# Altium project USB PD Hub.PrjPcb (part 1 of 2)
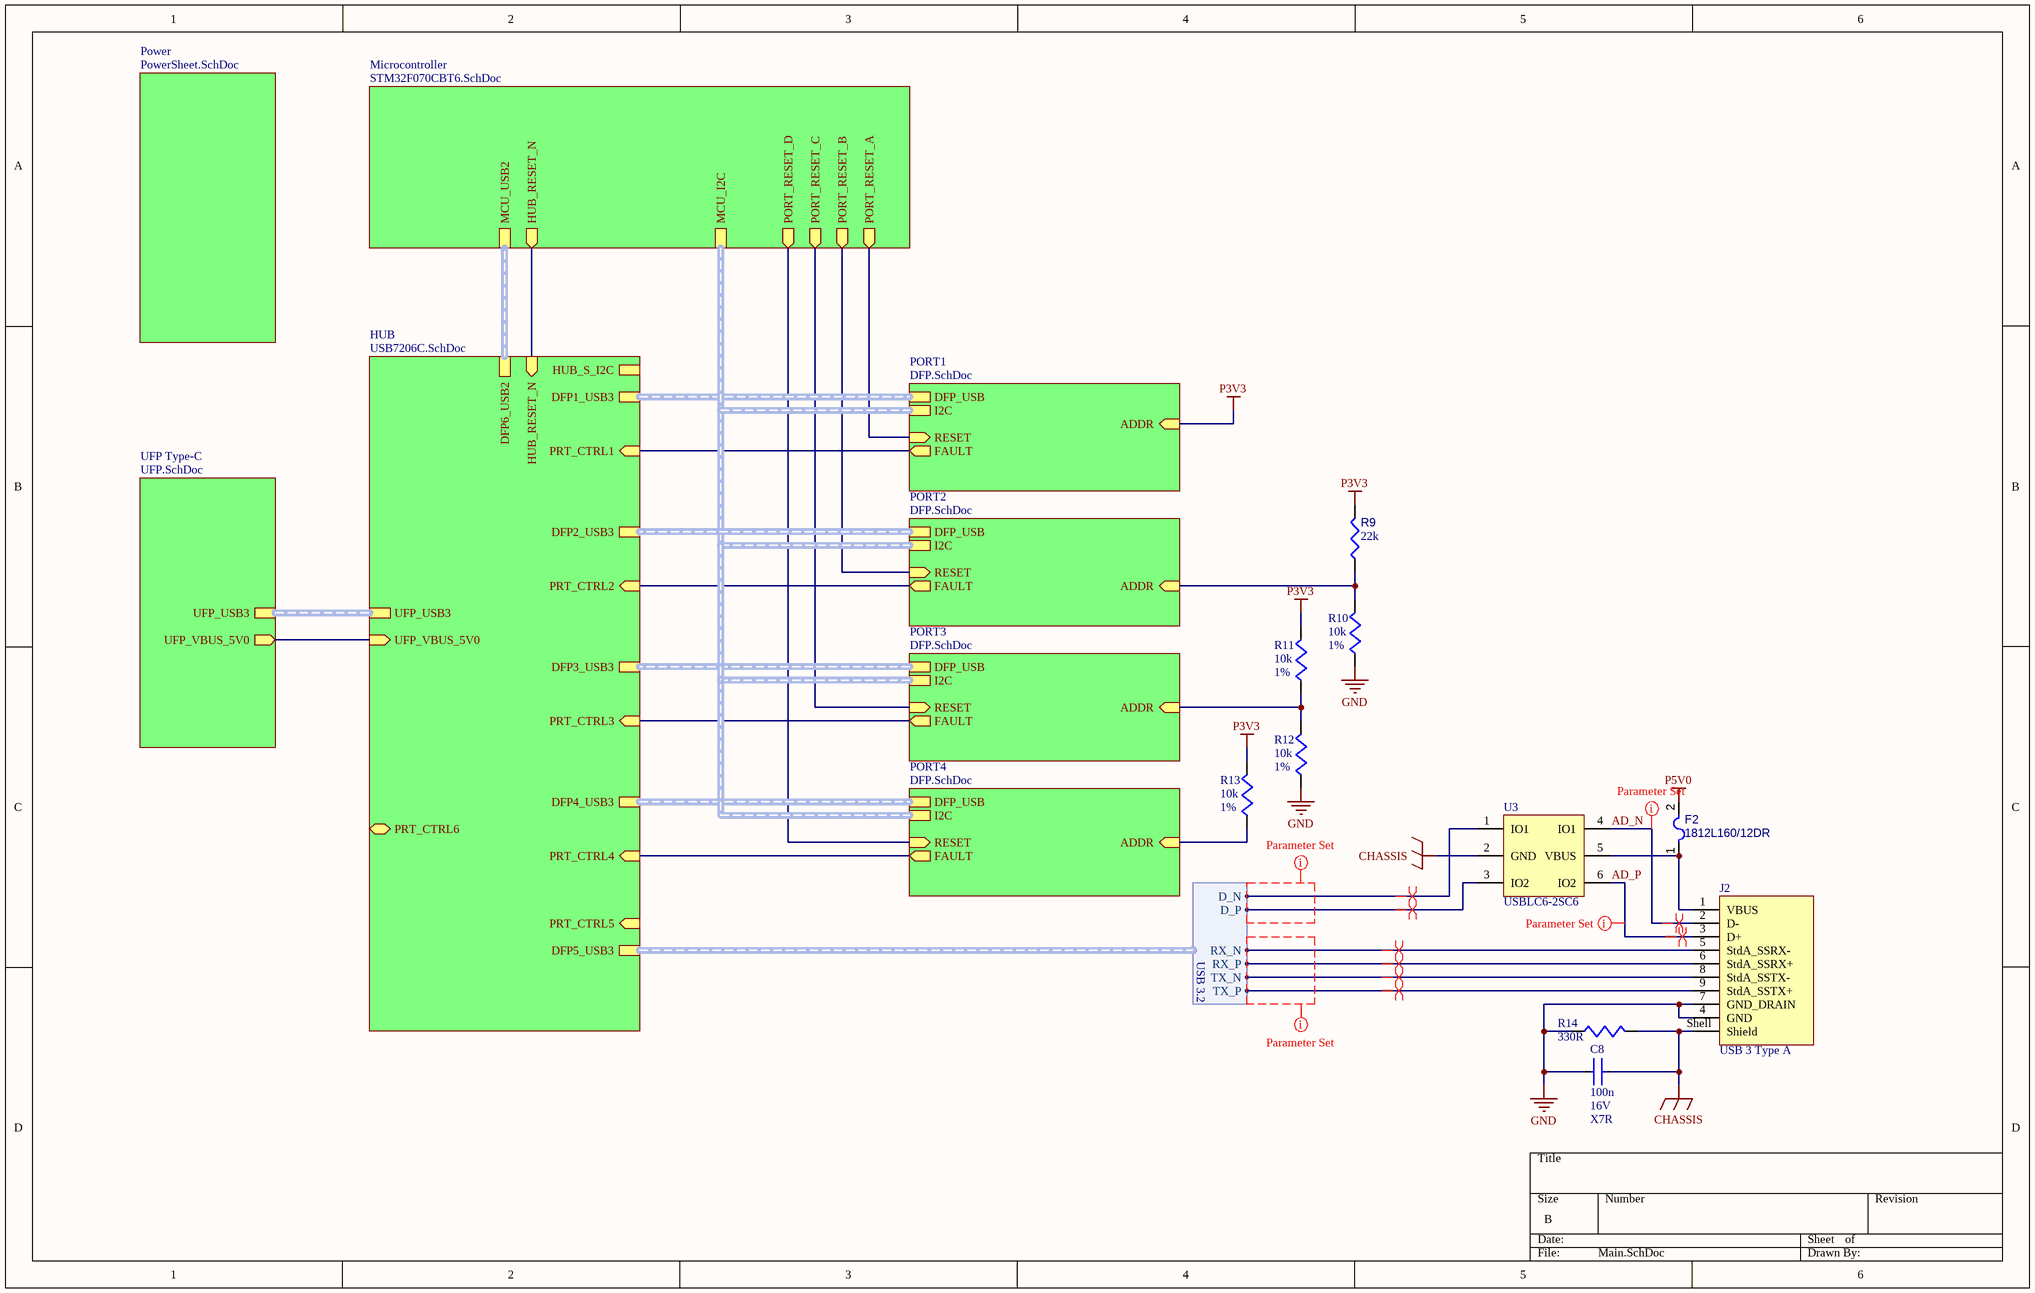
[diagram p0: Main.SchDoc]
8 sheets, 489 parts. Net scope: hierarchical (ports join the sheet entries above them; power ports are global).
Board file: PCB.PcbDoc
Sheets:
  Main.SchDoc
    PORT1 = DFP.SchDoc
      PD Controller = PD Controller.SchDoc
      PD Regulator = PD Regulator.SchDoc
    PORT2 = DFP.SchDoc
      PD Controller = PD Controller.SchDoc
      PD Regulator = PD Regulator.SchDoc
    PORT3 = DFP.SchDoc
      PD Controller = PD Controller.SchDoc
      PD Regulator = PD Regulator.SchDoc
    PORT4 = DFP.SchDoc
      PD Controller = PD Controller.SchDoc
      PD Regulator = PD Regulator.SchDoc
    UFP Type-C = UFP.SchDoc
    Microcontroller = STM32F070CBT6.SchDoc
    HUB = USB7206C.SchDoc
    Power = PowerSheet.SchDoc

## Sheet Main.SchDoc
size B; SheetNumber: 1; SheetTotal: 8

### Parts
C8  value 100n  Voltage: 16V  Dielectric: X7R  [CAPC1005X06N]  (hidden comment: 100nF 16V 0402)
F2  1812L160/12DR  [LFUS-1812L16012_V]
J2  USB 3 Type A  [692121030100]
R9  value 22k  [RESC0402(1005)_L]  (hidden comment: 22KR2F)
R10  value 10k  Tolerance: 1%  [RESC1005X04M]  (hidden comment: 10k 1% 0402)
R11  value 10k  Tolerance: 1%  [RESC1005X04M]  (hidden comment: 10k 1% 0402)
R12  value 10k  Tolerance: 1%  [RESC1005X04M]  (hidden comment: 10k 1% 0402)
R13  value 10k  Tolerance: 1%  [RESC1005X04M]  (hidden comment: 10k 1% 0402)
R14  value 330R  [RESC1005X04M]  (hidden comment: 330R 1% 0402)
U3  USBLC6-2SC6  [SOT95P280X145-6N]

### Sub-sheets
HUB = USB7206C.SchDoc: UFP_USB3 (harness USB 3.2), DFP1_USB3 (harness USB 3.2), DFP2_USB3 (harness USB 3.2), DFP3_USB3 (harness USB 3.2), DFP4_USB3 (harness USB 3.2), DFP6_USB2 (harness USB 2.0), UFP_VBUS_5V0 (in), DFP5_USB3 (harness USB 3.2), PRT_CTRL4 (in), PRT_CTRL3 (in), PRT_CTRL2 (in), PRT_CTRL1 (in), PRT_CTRL6 (bidir), HUB_S_I2C (harness S_I2C), HUB_RESET_N (in), PRT_CTRL5 (in)
Microcontroller = STM32F070CBT6.SchDoc: MCU_USB2 (harness USB 2.0), MCU_I2C, PORT_RESET_A (out), PORT_RESET_B (out), PORT_RESET_C (out), PORT_RESET_D (out), HUB_RESET_N (out)
PORT1 = DFP.SchDoc: DFP_USB (harness USB 3.2), I2C (harness I2C), ADDR (in), RESET (in), FAULT (out)
PORT2 = DFP.SchDoc: DFP_USB (harness USB 3.2), I2C (harness I2C), ADDR (in), RESET (in), FAULT (out)
PORT3 = DFP.SchDoc: DFP_USB (harness USB 3.2), I2C (harness I2C), ADDR (in), RESET (in), FAULT (out)
PORT4 = DFP.SchDoc: DFP_USB (harness USB 3.2), I2C (harness I2C), ADDR (in), RESET (in), FAULT (out)
Power = PowerSheet.SchDoc: no entries
UFP Type-C = UFP.SchDoc: UFP_USB3 (harness USB 3.2), UFP_VBUS_5V0 (out)

### Harnesses
USB 3.2: D_P, D_N, TX_P, TX_N, RX_P, RX_N

### Nets
CHASSIS: C8.1 J2.Shell(Shield) R14.2 U3.2(GND)
GND: C8.2 J2.4(GND) J2.7(GND_DRAIN) R10.1 R12.1 R14.1
P3V3: R9.2 R11.2 R13.2 ; sheet PORT1/ADDR
P5V0: F2.2
P5V0_UFP: sheet UFP Type-C/UFP_VBUS_5V0, sheet HUB/UFP_VBUS_5V0
AD_N: J2.2(D-) U3.4(IO1)
AD_P: J2.3(D+) U3.6(IO2)
ADCIN2: R9.1 R10.2 ; sheet PORT2/ADDR
ADCIN2: R11.1 R12.2 ; sheet PORT3/ADDR  [a separate net that carries the same name]
ADCIN2: R13.1 ; sheet PORT4/ADDR  [a separate net that carries the same name]
DP5_USB2_N: U3.1(IO1) ; sheet HUB/DFP5_USB3.D_N
DP5_USB2_P: U3.3(IO2) ; sheet HUB/DFP5_USB3.D_P
DP5_USB3_RX_N: J2.5(StdA_SSRX-) ; sheet HUB/DFP5_USB3.RX_N
DP5_USB3_RX_P: J2.6(StdA_SSRX+) ; sheet HUB/DFP5_USB3.RX_P
DP5_USB3_TX_N: J2.8(StdA_SSTX-) ; sheet HUB/DFP5_USB3.TX_N
DP5_USB3_TX_P: J2.9(StdA_SSTX+) ; sheet HUB/DFP5_USB3.TX_P
FAULT: sheet PORT1/FAULT, sheet HUB/PRT_CTRL1
FAULT: sheet PORT2/FAULT, sheet HUB/PRT_CTRL2  [a separate net that carries the same name]
FAULT: sheet PORT3/FAULT, sheet HUB/PRT_CTRL3  [a separate net that carries the same name]
FAULT: sheet PORT4/FAULT, sheet HUB/PRT_CTRL4  [a separate net that carries the same name]
HUB_RESET_N: sheet Microcontroller/HUB_RESET_N, sheet HUB/HUB_RESET_N
PDRESET_PD Controller: sheet PORT1/RESET, sheet Microcontroller/PORT_RESET_A
PDRESET_PD Controller: sheet PORT2/RESET, sheet Microcontroller/PORT_RESET_B  [a separate net that carries the same name]
PDRESET_PD Controller: sheet PORT3/RESET, sheet Microcontroller/PORT_RESET_C  [a separate net that carries the same name]
PDRESET_PD Controller: sheet PORT4/RESET, sheet Microcontroller/PORT_RESET_D  [a separate net that carries the same name]
NetF2_1: F2.1 J2.1(VBUS) U3.5(VBUS)

### Buses and harness runs
harness sheet HUB/DFP1_USB3 = sheet PORT1/DFP_USB
harness sheet HUB/DFP2_USB3 = sheet PORT2/DFP_USB
harness sheet HUB/DFP3_USB3 = sheet PORT3/DFP_USB
harness sheet HUB/DFP4_USB3 = sheet PORT4/DFP_USB
harness sheet HUB/DFP6_USB2 = sheet Microcontroller/MCU_USB2
harness sheet HUB/UFP_USB3 = sheet UFP Type-C/UFP_USB3
harness sheet Microcontroller/MCU_I2C = sheet PORT1/I2C = sheet PORT2/I2C = sheet PORT3/I2C = sheet PORT4/I2C

### Layout directives
net class USB2: (no net found under the mark), AD_N, AD_P
net class USB3: (no net found under the mark)
differential pair: AD_N, AD_P, DP5_USB2_N, DP5_USB2_P, DP5_USB3_RX_N, DP5_USB3_RX_P, DP5_USB3_TX_N, DP5_USB3_TX_P

### Library data of the parts
C8 = CMP-001-00088-2: 16V 100nF X7R ±10% 0402 Multilayer Ceramic Capacitors MLCC - SMD/SMT ROHS; LCSC Part #: C1525; Package: 0402
F2 = CMP-005-00006-3: POLY-FUSE(R) Resettable PTC, 12 V, 1.6 A, -40 to 85 degC, 2-Pin SMD, RoHS, Tape and Reel; Manufacturer: Littelfuse; Resistance: 100mohm; Current Rating: 100A; Nominal Supply Voltage: 12V; Max Operating Temperature: 85°C; Case/Package: 1812; Package Quantity: 1500; Datasheet URL: http://www.littelfuse.com/~/media/electronics/datasheets/resettable_ptcs/littelfuse_ptc_1812l_datasheet.pdf.pdf; Package Description: 2-Pin Surface Mount Device, Body 4.55 x 3.24 mm; Package Reference: 1812; Packaging: TapeandReel; Datasheet Version: Feb-16; Min Operating Temperature: -40°C; Mounting Technology: SM; RoHS Compliant: True
J2 = CMP-002-00126-1: USB Connector, 9 Contact(s), Female, Right Angle, Solder Terminal, Locking, Plug; Connector Type: TELECOM AND DATACOM CONNECTOR; Mounting Technology: Board; Max Operating Temperature: 85°C; Min Operating Temperature: -20°C; RoHS Compliant: Yes
R9 = CMP-009-00081-3: 22K 0.063W 1% 0402 (1005 Metric)  SMD; Power: 63mW; Mounting Technology: SMT; Tolerance: 1%; Case/Package: 0402; Pins: 2
R10-R13 = CMP-009-00187-1: 62.5mW Thick Film Resistors 50V ±100ppm/℃ ±1% 10kΩ 0402 Chip Resistor - Surface Mount ROHS; LCSC Part #: C60490; Package: 0402
R14 = CMP-009-00201-3: 62.5mW Thick Film Resistors 50V ±100ppm/℃ ±1% 330Ω 0402 Chip Resistor - Surface Mount ROHS; Tolerance: 1%; LCSC Part #: C105875; Package: 0402
U3 = CMP-015-00019-1: Trans Voltage Suppressor Diode, 5V V(RWM), Unidirectional, 1 Element, Silicon; LCSC Part #: C7519

## Sheet DFP.SchDoc
size B; SheetNumber: 5; SheetTotal: 8
Used 4 times, as channels PORT1, PORT2, PORT3, PORT4. Parts and nets are listed once, with the designators drawn on the sheet.
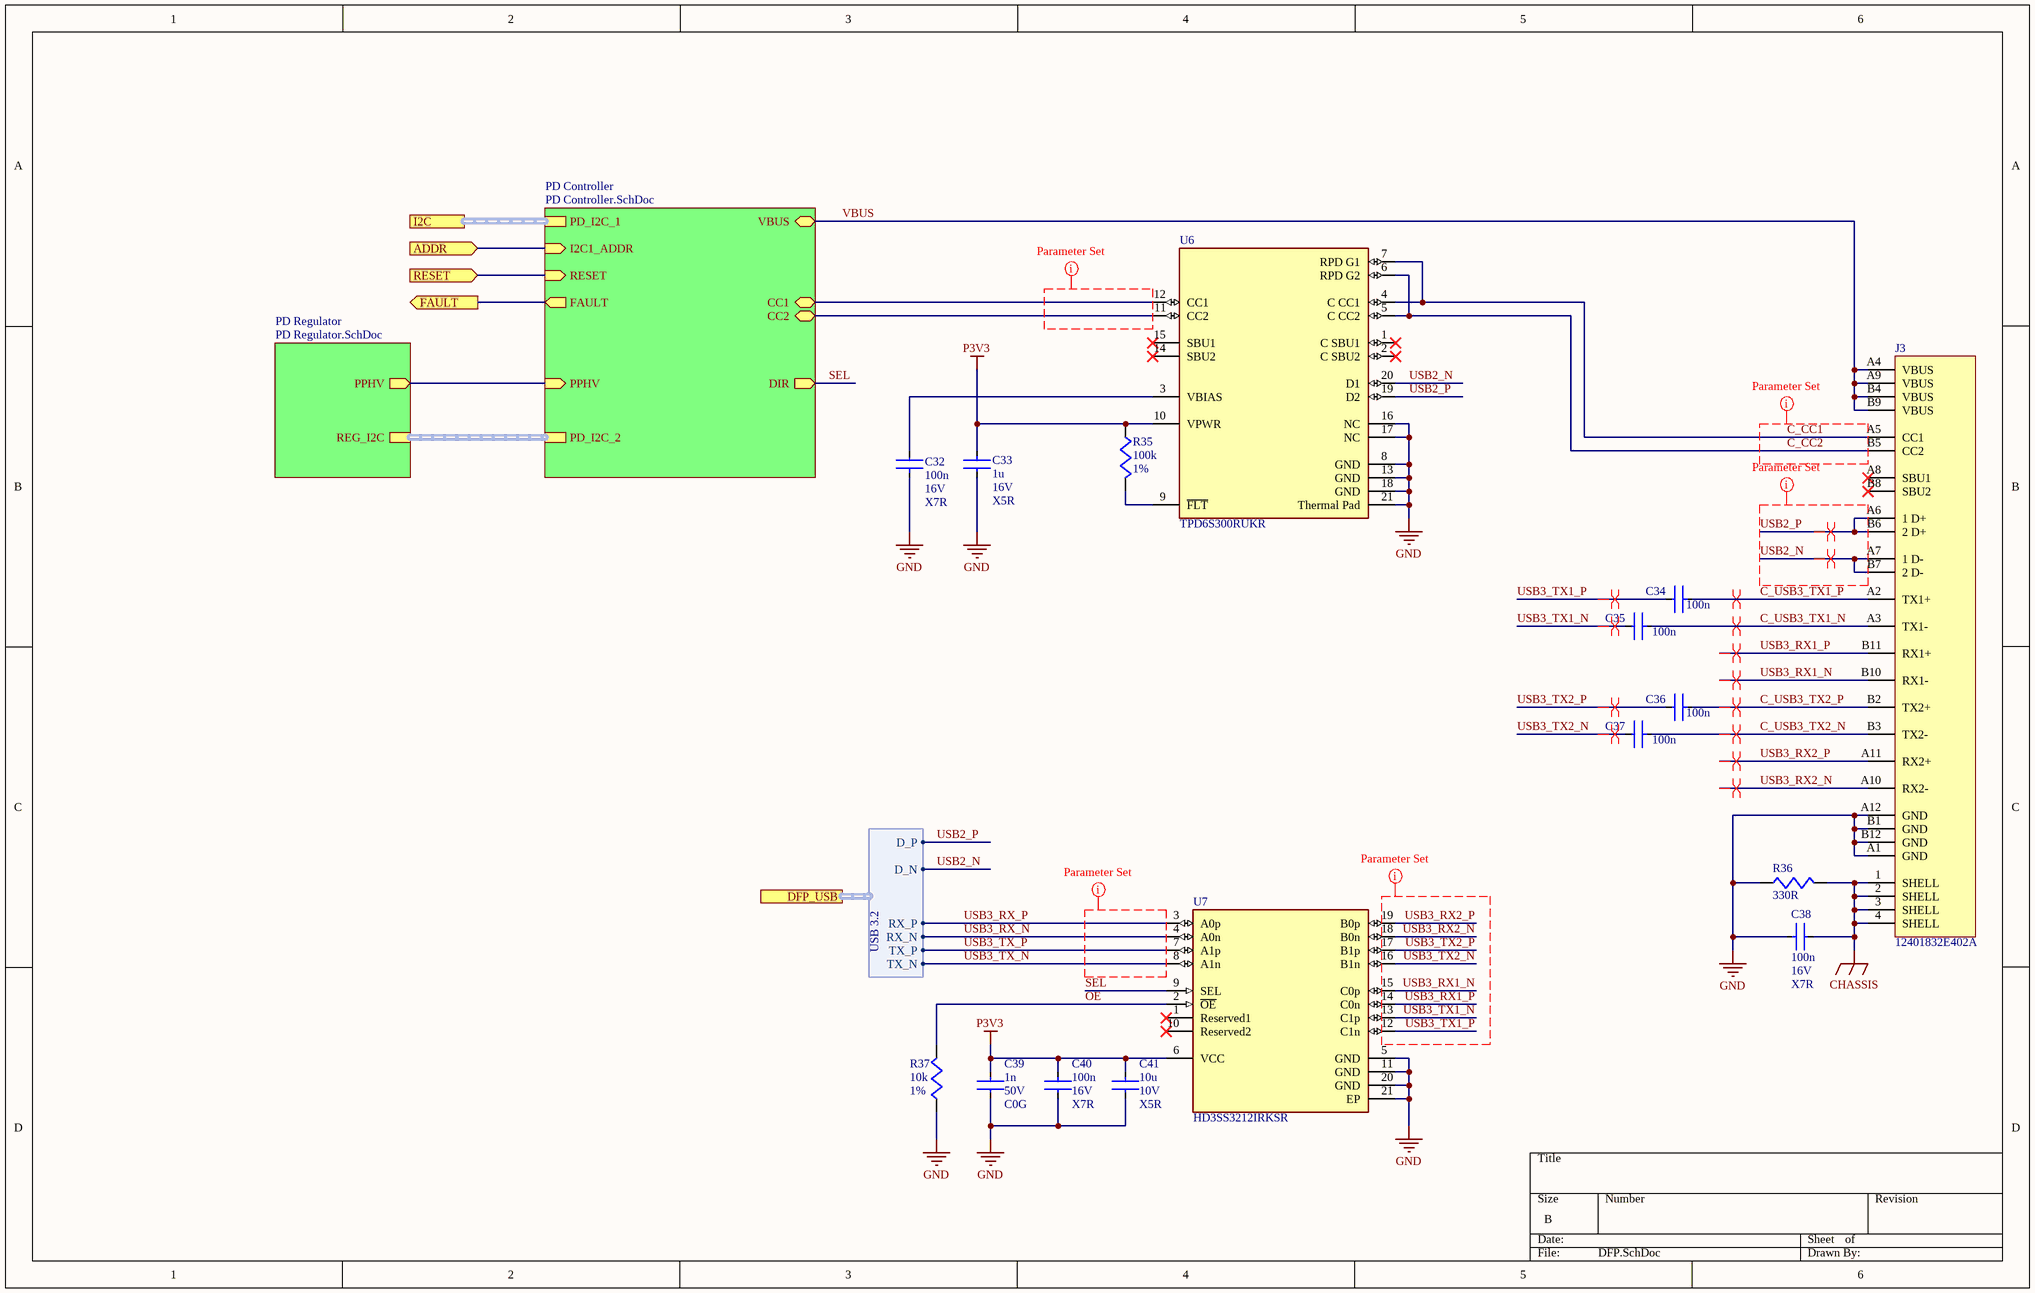
[diagram p1: DFP.SchDoc]

### Parts
C32  value 100n  Voltage: 16V  Dielectric: X7R  [CAPC1005X06N]  (hidden comment: 100nF 16V 0402)
C33  value 1u  Voltage: 16V  Dielectric: X5R  [CAPC1005X06N]  (hidden comment: 1uF 16V X5R 0402)
C34  value 100n  [CAPC0603X03N]  (hidden comment: 100nF 10V 0201)
C35  value 100n  [CAPC0603X03N]  (hidden comment: 100nF 10V 0201)
C36  value 100n  [CAPC0603X03N]  (hidden comment: 100nF 10V 0201)
C37  value 100n  [CAPC0603X03N]  (hidden comment: 100nF 10V 0201)
C38  value 100n  Voltage: 16V  Dielectric: X7R  [CAPC1005X06N]  (hidden comment: 100nF 16V 0402)
C39  value 1n  Voltage: 50V  Dielectric: C0G  [CAPC1608X08N]  (hidden comment: 1nF C0G 0603)
C40  value 100n  Voltage: 16V  Dielectric: X7R  [CAPC1005X06N]  (hidden comment: 100nF 16V 0402)
C41  value 10u  Voltage: 10V  Dielectric: X5R  [CAPC1005X06N]  (hidden comment: 10uF 10V 0402)
J3  12401832E402A  [FP-12401832E402A-MFG]
R35  value 100k  Tolerance: 1%  [RESC1005X04M]  (hidden comment: 100k 1% 0402)
R36  value 330R  [RESC1005X04M]  (hidden comment: 330R 1% 0402)
R37  value 10k  Tolerance: 1%  [RESC1005X04M]  (hidden comment: 10k 1% 0402)
U6  TPD6S300RUKR  [FP-RUK0020B-MFG]
U7  HD3SS3212IRKSR  [FP-RKS0020A-MFG]

### Sub-sheets
PD Controller = PD Controller.SchDoc: CC1 (bidir), CC2 (bidir), VBUS (bidir), PD_I2C_1 (harness i2C), PD_I2C_2 (harness I2C), I2C1_ADDR (in), PPHV (in), DIR (out), FAULT (out), RESET (in)
PD Regulator = PD Regulator.SchDoc: REG_I2C (harness I2C), PPHV (out)

### Ports
ADDR (in, see Main[4B]), DFP_USB (harness USB 3.2, see Main[3B]), FAULT (out, see Main[3B], PD Controller[2C]), I2C (harness I2C, see Main[3B]), RESET (in, see Main[3B], PD Controller[2C])

### Harnesses
USB 3.2: D_P, D_N, TX_P, TX_N, RX_P, RX_N

### Nets
CHASSIS: C38.2 J3.1(SHELL) J3.2(SHELL) J3.3(SHELL) J3.4(SHELL) R36.1
GND: C32.1 C33.2 C38.1 C39.2 C40.2 C41.2 J3.A1(GND) J3.A12(GND) J3.B1(GND) J3.B12(GND) R36.2 R37.1 U6.8(GND) U6.13(GND) U6.16(NC) U6.17(NC) U6.18(GND) U6.21(Thermal_Pad) U7.5(GND) U7.11(GND) U7.20(GND) U7.21(EP)
P3V3: C33.1 C39.1 C40.1 C41.1 R35.1 U6.10(VPWR) U7.6(VCC)
ADDR: port ADDR, sheet PD Controller/I2C1_ADDR
C_CC1: J3.A5(CC1) U6.4(C_CC1) U6.7(RPD_G1)
C_CC2: J3.B5(CC2) U6.5(C_CC2) U6.6(RPD_G2)
C_USB3_TX1_N: C35.1 J3.A3(TX1-)
C_USB3_TX1_P: C34.1 J3.A2(TX1+)
C_USB3_TX2_N: C37.1 J3.B3(TX2-)
C_USB3_TX2_P: C36.1 J3.B2(TX2+)
FAULT: port FAULT, sheet PD Controller/FAULT
OE: R37.2 U7.2(~{OE})
RESET: port RESET, sheet PD Controller/RESET
SEL: U7.9(SEL) ; sheet PD Controller/DIR
USB2_N: J3.A7(1_D-) J3.B7(2_D-) U6.20(D1) ; port DFP_USB.D_N
USB2_P: J3.A6(1_D+) J3.B6(2_D+) U6.19(D2) ; port DFP_USB.D_P
USB3_RX1_N: J3.B10(RX1-) U7.15(C0p)
USB3_RX1_P: J3.B11(RX1+) U7.14(C0n)
USB3_RX2_N: J3.A10(RX2-) U7.18(B0n)
USB3_RX2_P: J3.A11(RX2+) U7.19(B0p)
USB3_RX_N: U7.4(A0n) ; port DFP_USB.RX_N
USB3_RX_P: U7.3(A0p) ; port DFP_USB.RX_P
USB3_TX1_N: C35.2 U7.13(C1p)
USB3_TX1_P: C34.2 U7.12(C1n)
USB3_TX2_N: C37.2 U7.16(B1n)
USB3_TX2_P: C36.2 U7.17(B1p)
USB3_TX_N: U7.8(A1n) ; port DFP_USB.TX_N
USB3_TX_P: U7.7(A1p) ; port DFP_USB.TX_P
VBUS: J3.A4(VBUS) J3.A9(VBUS) J3.B4(VBUS) J3.B9(VBUS) ; sheet PD Controller/VBUS
NetC32_2: C32.2 U6.3(VBIAS)
NetR35_2: R35.2 U6.9(~{FLT})
NetU6_11: U6.11(CC2) ; sheet PD Controller/CC2
NetU6_12: U6.12(CC1) ; sheet PD Controller/CC1
(unnamed): sheet PD Controller/PPHV, sheet PD Regulator/PPHV

Not connected (* = marked no-connect by the designer): J3 A8(SBU1)* B8(SBU2)*; U6 1(C_SBU1)* 2(C_SBU2)* 14(SBU2)* 15(SBU1)*; U7 1(Reserved1)* 10(Reserved2)*

### Channels
PORT1: designators end in A; ports ADDR=P3V3 FAULT=FAULT RESET=PDRESET_PD Controller
PORT2: designators end in B; ports ADDR=ADCIN2 FAULT=FAULT RESET=PDRESET_PD Controller
PORT3: designators end in C; ports ADDR=ADCIN2 FAULT=FAULT RESET=PDRESET_PD Controller
PORT4: designators end in D; ports ADDR=ADCIN2 FAULT=FAULT RESET=PDRESET_PD Controller

### Buses and harness runs
harness port I2C = sheet PD Controller/PD_I2C_1
harness sheet PD Controller/PD_I2C_2 = sheet PD Regulator/REG_I2C

### Layout directives
net class USB2: USB2_N, USB2_P
net class USB3: (no net found under the mark), USB3_RX1_N, USB3_RX1_P, USB3_RX2_N, USB3_RX2_P, USB3_TX1_N, USB3_TX1_P, USB3_TX2_N, USB3_TX2_P
differential pair; differential pair class DIFF90: C_USB3_TX1_N_PORT1, C_USB3_TX1_P_PORT1, C_USB3_TX2_N_PORT1, C_USB3_TX2_P_PORT1, DP1_USB2_N, DP1_USB2_P, USB3_RX1_N_PORT1, USB3_RX1_P_PORT1, USB3_RX2_N_PORT1, USB3_RX2_P_PORT1, USB3_TX1_N_PORT1, USB3_TX1_P_PORT1, USB3_TX2_N_PORT1, USB3_TX2_P_PORT1
net class CC: (no net found under the mark), C_CC1, C_CC2

### Library data of the parts
C32 C38 = CMP-001-00088-2: as C8 on sheet Main; LCSC Part #: C1525; Package: 0402
C33 = CMP-001-00098-2: 16V 1uF X5R ±10% 0402 Multilayer Ceramic Capacitors MLCC - SMD/SMT ROHS; Package: 0402; LCSC Part #: C29266
C34-C37 = CMP-001-00107-2: 10V 100nF X5R ±10% 0201 Multilayer Ceramic Capacitors MLCC - SMD/SMT ROHS; Voltage: 10V; Dielectric: X5R; Package: 0402; LCSC Part #: C76934
C39 = CMP-001-00103-2: C0G 1nF 50V ±5% 0603 Multilayer Ceramic Capacitors MLCC - SMD/SMT ROHS; LCSC Part #: C342541; Package: 0603
C40 = CMP-001-00088-1: 16V 100nF X7R ±10% 0402 Multilayer Ceramic Capacitors MLCC - SMD/SMT ROHS; LCSC Part #: C1525; Package: 0402
C41 = CMP-001-00084-1: 10uF 10V 0402 20% X5R CAP MLCC; LCSC Part #: C527590; Footprint: 0402
J3 = CMP-002-00130-1: Conn USB Type C RCP 24 POS 0.25mm Solder RA SMD 24 Terminal 1 Port T/R; LCSC Part #: C464604
R35 = CMP-009-00218-2: 62.5mW Thick Film Resistors 50V ±100ppm/℃ ±1% 100kΩ 0402 Chip Resistor - Surface Mount ROHS; Package: 0402; LCSC Part #: C60491
R36 = CMP-009-00201-3: as R14 on sheet Main; Tolerance: 1%; LCSC Part #: C105875; Package: 0402
R37 = CMP-009-00187-1: as R10 on sheet Main; LCSC Part #: C60490; Package: 0402
U6 = CMP-019-00064-3: WQFN-20-EP(3x3) ESD and Surge Protection (TVS/ESD) ROHS; Package: WQFN-20-EP; LCSC Part #: C2649810
U7 = CMP-001-0010-5: 2-channel 10-Gbps 2: 1/1: 2 USB 3.1 differential mux/demux 20-VQFN -40 to 85; Number of Channels: 2; Min Supply Voltage: 3V; Data Rate: 480Mbps; -3db Bandwidth: 8GHz; Max Supply Voltage: 3.6V; USB Standard: USB 3.1; Nominal Supply Current: 600uA; Max Operating Temperature: 85°C; Pins: 20; Packaging: Cut Tape; Min Operating Temperature: -40°C; Height: 1mm; Length: 4.5mm; Number of Ports: 2; Mounting Technology: Surface Mount; Width: 2.5mm; Interface: USB; Case/Package: VQFN; Reach SVHC Compliant: No; Series: -; Lead Free: Lead Free; Thickness: 900um

## Sheet PD Controller.SchDoc
size B; SheetNumber: 6; SheetTotal: 8
Used 4 times, as channels PORT1/PD Controller, PORT2/PD Controller, PORT3/PD Controller, PORT4/PD Controller. Parts and nets are listed once, with the designators drawn on the sheet.
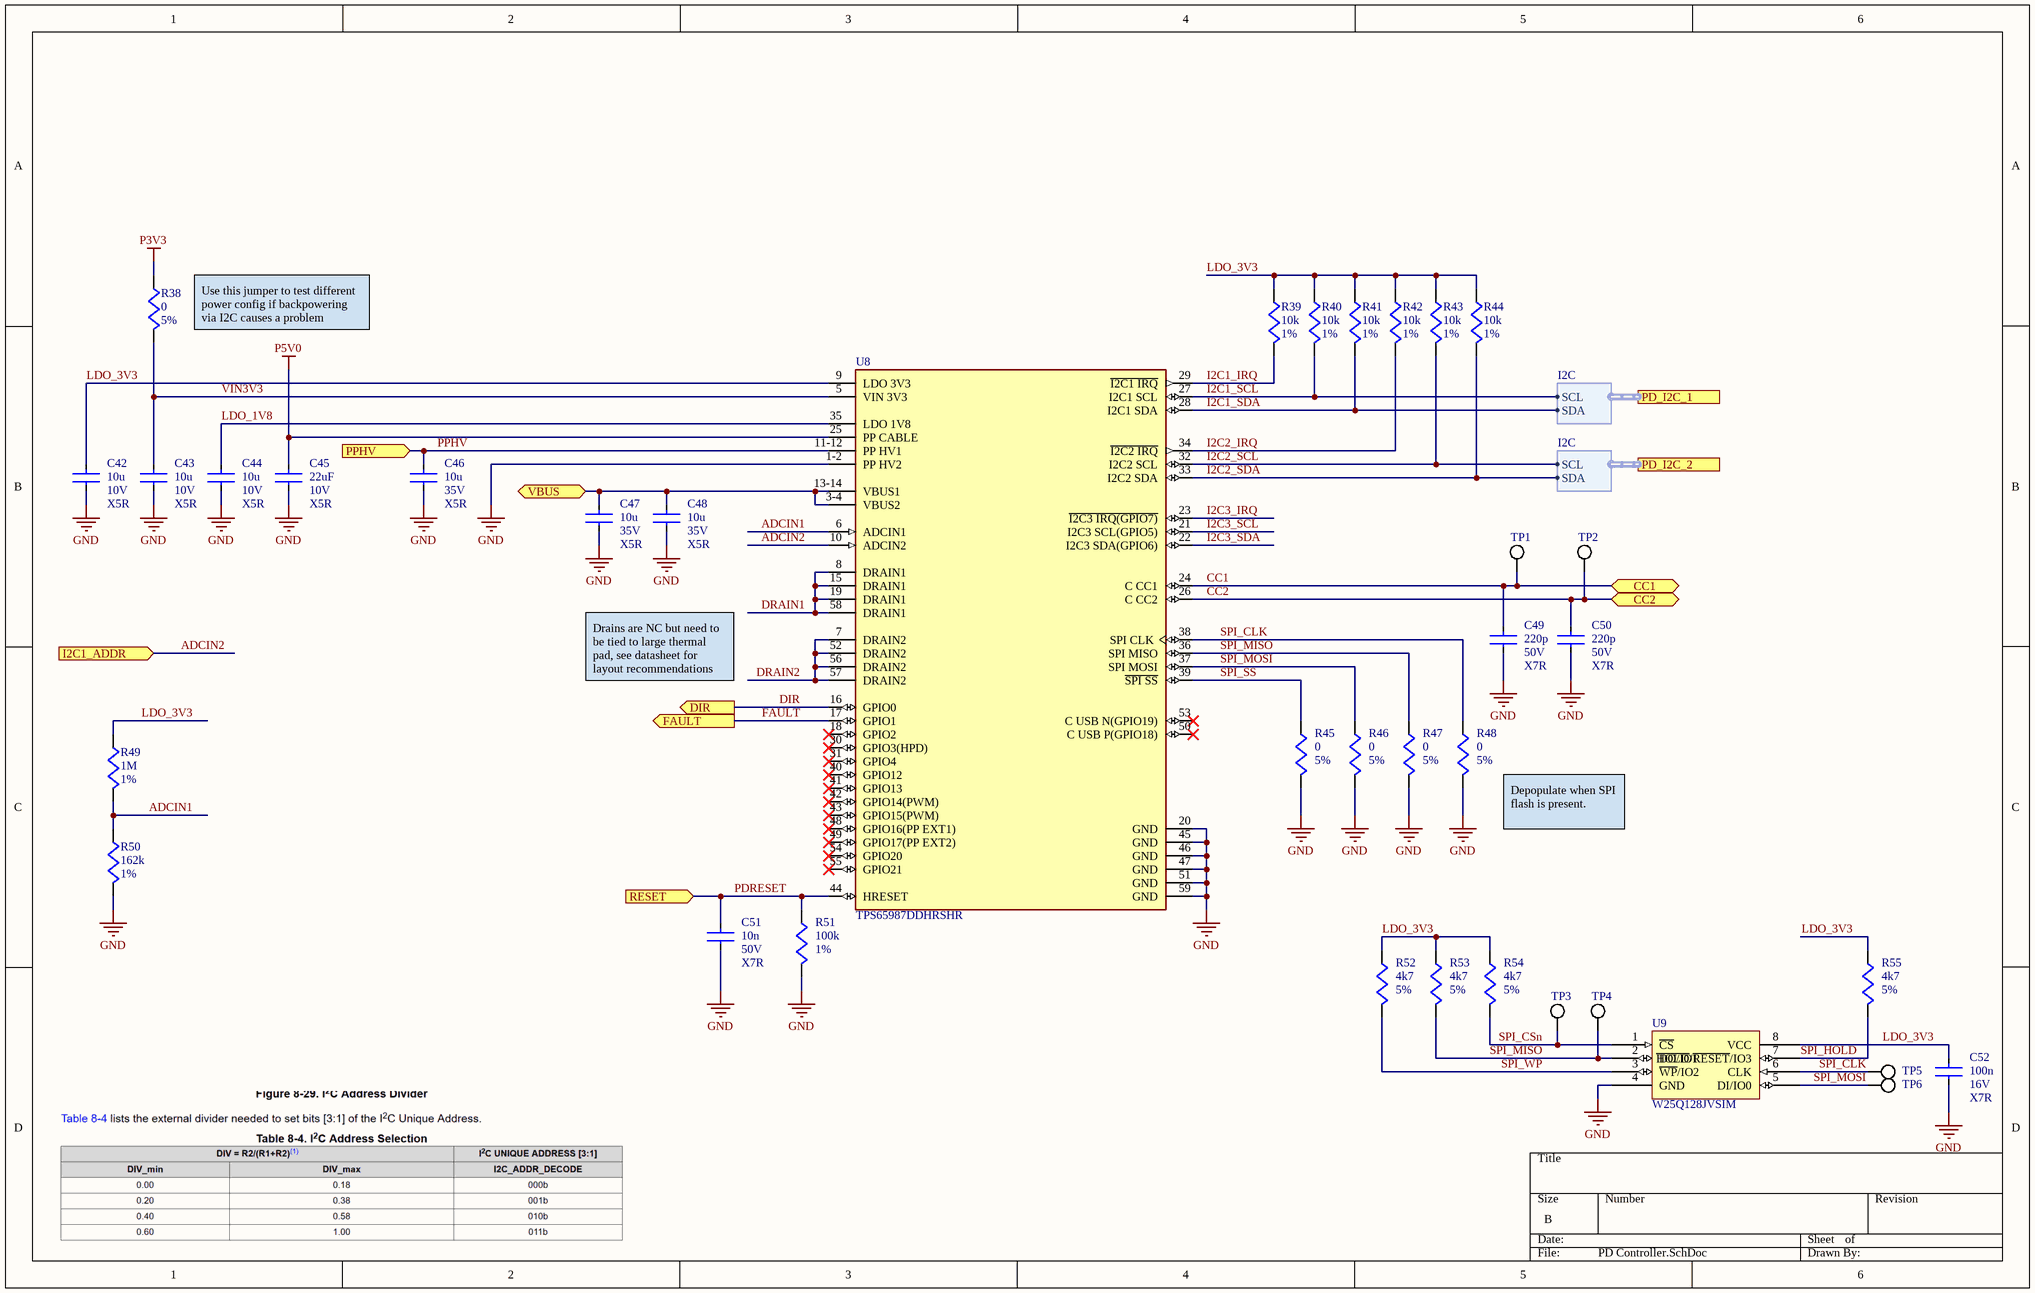
[diagram p2: PD Controller.SchDoc]

### Parts
C42  value 10u  Voltage: 10V  Dielectric: X5R  [CAPC1005X06N]  (hidden comment: 10uF 10V 0402)
C43  value 10u  Voltage: 10V  Dielectric: X5R  [CAPC1005X06N]  (hidden comment: 10uF 10V 0402)
C44  value 10u  Voltage: 10V  Dielectric: X5R  [CAPC1005X06N]  (hidden comment: 10uF 10V 0402)
C45  value 22uF  Voltage: 10V  Dielectric: X5R  [CAPC1608X08N]  (hidden comment: 22uF 10V 0603 X5R)
C46  value 10u  Voltage: 35V  Dielectric: X5R  [CAPC1608X08N]  (hidden comment: 10uF 35V 0603)
C47  value 10u  Voltage: 35V  Dielectric: X5R  [CAPC1608X08N]  (hidden comment: 10uF 35V 0603)
C48  value 10u  Voltage: 35V  Dielectric: X5R  [CAPC1608X08N]  (hidden comment: 10uF 35V 0603)
C49  value 220p  Voltage: 50V  Dielectric: X7R  [CAPC1005X06N]  (hidden comment: 220pF 50V 0402)
C50  value 220p  Voltage: 50V  Dielectric: X7R  [CAPC1005X06N]  (hidden comment: 220pF 50V 0402)
C51  value 10n  Voltage: 50V  Dielectric: X7R  [CAPC1005X06N]  (hidden comment: 10n 50V X7R 0402)
C52  value 100n  Voltage: 16V  Dielectric: X7R  [CAPC1005X06N]  (hidden comment: 100nF 16V 0402)
R38  value 0  Tolerance: 5%  [RESC1005X04M]  (hidden comment: 0 Ohm 1% 0402)
R39  value 10k  Tolerance: 1%  [RESC1005X04M]  (hidden comment: 10k 1% 0402)
R40  value 10k  Tolerance: 1%  [RESC1005X04M]  (hidden comment: 10k 1% 0402)
R41  value 10k  Tolerance: 1%  [RESC1005X04M]  (hidden comment: 10k 1% 0402)
R42  value 10k  Tolerance: 1%  [RESC1005X04M]  (hidden comment: 10k 1% 0402)
R43  value 10k  Tolerance: 1%  [RESC1005X04M]  (hidden comment: 10k 1% 0402)
R44  value 10k  Tolerance: 1%  [RESC1005X04M]  (hidden comment: 10k 1% 0402)
R45  value 0  Tolerance: 5%  [RESC1005X04M]  (hidden comment: 0 Ohm 1% 0402)
R46  value 0  Tolerance: 5%  [RESC1005X04M]  (hidden comment: 0 Ohm 1% 0402)
R47  value 0  Tolerance: 5%  [RESC1005X04M]  (hidden comment: 0 Ohm 1% 0402)
R48  value 0  Tolerance: 5%  [RESC1005X04M]  (hidden comment: 0 Ohm 1% 0402)
R49  value 1M  Tolerance: 1%  [RESC1005X04M]  (hidden comment: 1M 1% 0402)
R50  value 162k  Tolerance: 1%  [RESC1005X04M]  (hidden comment: 162k 1% 0402)
R51  value 100k  Tolerance: 1%  [RESC1005X04M]  (hidden comment: 100k 1% 0402)
R52  value 4k7  Tolerance: 5%  [RESC1005X04M]  (hidden comment: 4.7k 5% 0402)
R53  value 4k7  Tolerance: 5%  [RESC1005X04M]  (hidden comment: 4.7k 5% 0402)
R54  value 4k7  Tolerance: 5%  [RESC1005X04M]  (hidden comment: 4.7k 5% 0402)
R55  value 4k7  Tolerance: 5%  [RESC1005X04M]  (hidden comment: 4.7k 5% 0402)
TP1  45mil Test Point  [45mil Test Point Footprint]  (value not drawn)  (no BOM)
TP2  45mil Test Point  [45mil Test Point Footprint]  (value not drawn)  (no BOM)
TP3  45mil Test Point  [45mil Test Point Footprint]  (value not drawn)  (no BOM)
TP4  45mil Test Point  [45mil Test Point Footprint]  (value not drawn)  (no BOM)
TP5  45mil Test Point  [45mil Test Point Footprint]  (value not drawn)  (no BOM)
TP6  45mil Test Point  [45mil Test Point Footprint]  (value not drawn)  (no BOM)
U8  TPS65987DDHRSHR  [FP-RSH0056E-MFG]
U9  W25Q128JVSIM  [SOIC127P790X216-8N]

### Ports
CC1 (bidir, see DFP[3A]), CC2 (bidir, see DFP[3A]), DIR (out, see DFP[3B]), FAULT (out, see DFP[2A]), I2C1_ADDR (in, see DFP[2A]), PD_I2C_1 (harness i2C, see DFP[2A]), PD_I2C_2 (harness I2C, see DFP[2B]), PPHV (in, see DFP[2B], PD Regulator[6C]), RESET (in, see DFP[2A]), VBUS (bidir, see DFP[3A])

### Harnesses
I2C: SCL, SDA

### Nets
GND: C42.2 C43.2 C44.2 C45.2 C46.2 C47.2 C48.2 C49.2 C50.2 C51.2 C52.2 R45.2 R46.2 R47.2 R48.2 R50.2 R51.2 U8.1-2(PP_HV2) U8.20(GND) U8.45(GND) U8.46(GND) U8.47(GND) U8.51(GND) U8.59(GND) U9.4(GND)
P3V3: R38.1
P5V0: C45.1 U8.25(PP_CABLE)
ADCIN1: R49.2 R50.1 U8.6(ADCIN1)
ADCIN2: U8.10(ADCIN2) ; port I2C1_ADDR
CC1: C49.1 TP1.0 U8.24(C_CC1) ; port CC1
CC2: C50.1 TP2.0 U8.26(C_CC2) ; port CC2
DIR: U8.16(GPIO0) ; port DIR
DRAIN1: U8.8(DRAIN1) U8.15(DRAIN1) U8.19(DRAIN1) U8.58(DRAIN1)
DRAIN2: U8.7(DRAIN2) U8.52(DRAIN2) U8.56(DRAIN2) U8.57(DRAIN2)
FAULT: U8.17(GPIO1) ; port FAULT
I2C1_IRQ: R39.2 U8.29(~{I2C1_IRQ})
I2C1_SCL: R40.2 U8.27(I2C1_SCL) ; port PD_I2C_1.SCL
I2C1_SDA: R41.2 U8.28(I2C1_SDA) ; port PD_I2C_1.SDA
I2C2_IRQ: R42.2 U8.34(~{I2C2_IRQ})
I2C2_SCL: R43.2 U8.32(I2C2_SCL) ; port PD_I2C_2.SCL
I2C2_SDA: R44.2 U8.33(I2C2_SDA) ; port PD_I2C_2.SDA
I2C3_IRQ: U8.23(~{I2C3_IRQ(GPIO7)})
I2C3_SCL: U8.21(I2C3_SCL(GPIO5))
I2C3_SDA: U8.22(I2C3_SDA(GPIO6))
LDO_1V8: C44.1 U8.35(LDO_1V8)
LDO_3V3: C42.1 C52.1 R39.1 R40.1 R41.1 R42.1 R43.1 R44.1 R49.1 R52.1 R53.1 R54.1 R55.1 U8.9(LDO_3V3) U9.8(VCC)
PDRESET: C51.1 R51.1 U8.44(HRESET) ; port RESET
PPHV: C46.1 U8.11-12(PP_HV1) ; port PPHV
SPI_CLK: R48.1 TP5.0 U8.38(SPI_CLK) U9.6(CLK)
SPI_CSn: R54.2 TP3.0 U9.1(~{CS})
SPI_HOLD: R55.2 U9.7(~{HOLD}/~{RESET}/IO3)
SPI_MISO: R47.1 R53.2 TP4.0 U8.36(SPI_MISO) U9.2(DO/IO1)
SPI_MOSI: R46.1 TP6.0 U8.37(SPI_MOSI) U9.5(DI/IO0)
SPI_SS: R45.1 U8.39(~{SPI_SS})
SPI_WP: R52.2 U9.3(~{WP}/IO2)
VBUS: C47.1 C48.1 U8.3-4(VBUS2) U8.13-14(VBUS1) ; port VBUS
VIN3V3: C43.1 R38.2 U8.5(VIN_3V3)

Not connected (* = marked no-connect by the designer): U8 18(GPIO2)* 30(GPIO3(HPD))* 31(GPIO4)* 40(GPIO12)* 41(GPIO13)* 42(GPIO14(PWM))* 43(GPIO15(PWM))* 48(GPIO16(PP_EXT1))* 49(GPIO17(PP_EXT2))* 50(C_USB_P(GPIO18))* 53(C_USB_N(GPIO19))* 54(GPIO20)* 55(GPIO21)*

### Channels
PORT1/PD Controller: designators end in A; ports CC1=CC1 CC2=CC2 DIR=DIR FAULT=FAULT I2C1_ADDR=P3V3 PPHV=PPHV RESET=PDRESET_PD Controller VBUS=VBUS_PORT1
PORT2/PD Controller: designators end in B; ports CC1=CC1 CC2=CC2 DIR=DIR FAULT=FAULT I2C1_ADDR=ADCIN2 PPHV=PPHV RESET=PDRESET_PD Controller VBUS=VBUS_PORT2
PORT3/PD Controller: designators end in C; ports CC1=CC1 CC2=CC2 DIR=DIR FAULT=FAULT I2C1_ADDR=ADCIN2 PPHV=PPHV RESET=PDRESET_PD Controller VBUS=VBUS_PORT3
PORT4/PD Controller: designators end in D; ports CC1=CC1 CC2=CC2 DIR=DIR FAULT=FAULT I2C1_ADDR=ADCIN2 PPHV=PPHV RESET=PDRESET_PD Controller VBUS=VBUS_PORT4

### Notes on the sheet
- (near R38) Use this jumper to test different power config if backpowering via I2C causes a problem
- Drains are NC but need to be tied to large thermal pad, see datasheet for layout recommendations
- (near R48) Depopulate when SPI flash is present.

### Library data of the parts
C42-C44 = CMP-001-00084-2: 10uF 10V 0402 20% X5R CAP MLCC; Footprint: 0402; LCSC Part #: C527590
C45 = CMP-001-00110-1: 10V 22uF X5R ±20% 0603 Multilayer Ceramic Capacitors MLCC - SMD/SMT ROHS; LCSC Part #: C86295; Package: 0603
C46-C48 = CMP-001-00102-2: 35V 10uF X5R ±20% 0603 Multilayer Ceramic Capacitors MLCC - SMD/SMT ROHS; LCSC Part #: C194427; Package: 0603
C49 C50 = CMP-001-00115-1: 50V 220pF X7R ±10% 0402 Multilayer Ceramic Capacitors MLCC - SMD/SMT ROHS; LCSC Part #: C107025; Package: 0402
C51 = CMP-001-00116-1: 50V 10nF X7R ±10% 0402 Multilayer Ceramic Capacitors MLCC - SMD/SMT ROHS; LCSC Part #: C60133; Package: 0402
C52 = CMP-001-00088-2: as C8 on sheet Main; LCSC Part #: C1525; Package: 0402
R38 R45-R48 = CMP-009-00232-1: 62.5mW Thick Film Resistors 50V ±5% 0Ω 0402 Chip Resistor - Surface Mount ROHS; Package: 0402; LCSC Part #: C60485
R39-R44 = CMP-009-00187-2: 62.5mW Thick Film Resistors 50V ±100ppm/℃ ±1% 10kΩ 0402 Chip Resistor - Surface Mount ROHS; Package: 0402; LCSC Part #: C60490
R49 = CMP-009-00240-1: 62.5mW Thick Film Resistors 50V ±100ppm/℃ ±1% 1MΩ 0402 Chip Resistor - Surface Mount ROHS; LCSC Part #: C138033; Package: 0402
R50 = CMP-009-00217-3: 62.5mW Thick Film Resistors 50V ±100ppm/℃ ±1% 162kΩ 0402 Chip Resistor - Surface Mount ROHS; LCSC Part #: C54068; Package: 0402
R51 = CMP-009-00218-2: as R35 on sheet DFP; Package: 0402; LCSC Part #: C60491
R52-R55 = CMP-009-00197-2: 62.5mW Thick Film Resistors 50V ±100ppm/℃ ±5% 4.7kΩ 0402 Chip Resistor - Surface Mount ROHS; Package: 0402; LCSC Part #: C105870
TP1-TP6 = CMP-001-0001-7: 45mil SMD test point
U8 = CMP-019-00062-1: USB Type-C™ and USB PD controller with integrated power switches 56-VQFN -10 to 75
U9 = CMP-019-00052-3: NOR Flash Serial (SPI, Dual SPI, Quad SPI) 3V/3.3V 128M-bit 16M x 8 6ns 8-Pin SOIC Tube

## Sheet PD Regulator.SchDoc
size B; SheetNumber: 7; SheetTotal: 8
Used 4 times, as channels PORT1/PD Regulator, PORT2/PD Regulator, PORT3/PD Regulator, PORT4/PD Regulator. Parts and nets are listed once, with the designators drawn on the sheet.
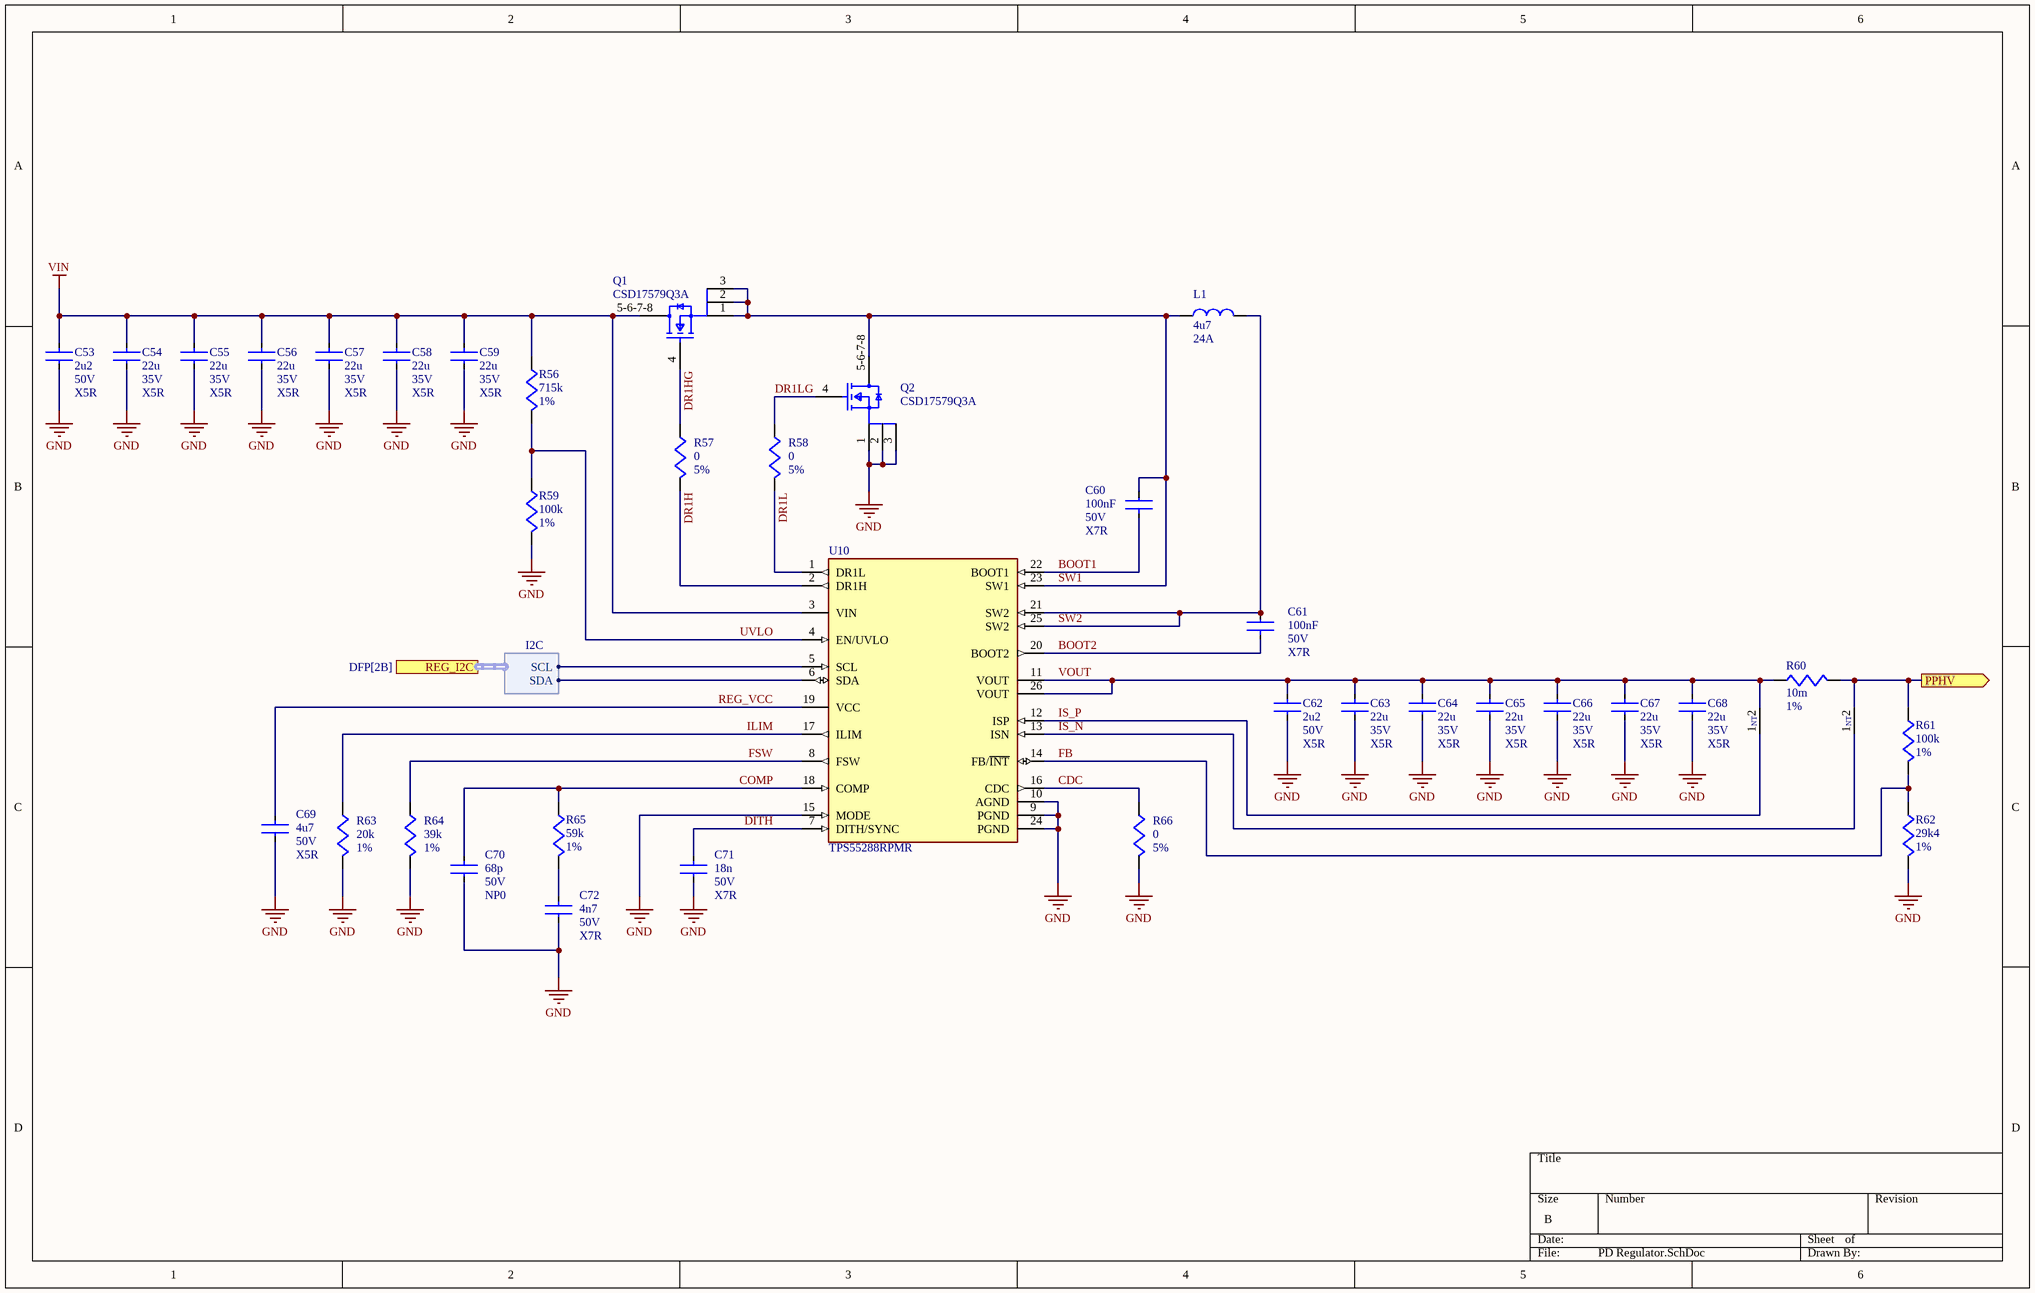
[diagram p3: PD Regulator.SchDoc]

### Parts
C53  value 2u2  Voltage: 50V  Dielectric: X5R  [CAPC2012X14N]  (hidden comment: 2.2uF 50V 0805)
C54  value 22u  Voltage: 35V  Dielectric: X5R  [CAPC3225X18N]  (hidden comment: 22uF 35V 1210 X5R)
C55  value 22u  Voltage: 35V  Dielectric: X5R  [CAPC3225X18N]  (hidden comment: 22uF 35V 1210 X5R)
C56  value 22u  Voltage: 35V  Dielectric: X5R  [CAPC3225X18N]  (hidden comment: 22uF 35V 1210 X5R)
C57  value 22u  Voltage: 35V  Dielectric: X5R  [CAPC3225X18N]  (hidden comment: 22uF 35V 1210 X5R)
C58  value 22u  Voltage: 35V  Dielectric: X5R  [CAPC3225X18N]  (hidden comment: 22uF 35V 1210 X5R)
C59  value 22u  Voltage: 35V  Dielectric: X5R  [CAPC3225X18N]  (hidden comment: 22uF 35V 1210 X5R)
C60  value 100nF  Voltage: 50V  Dielectric: X7R  [CAPC1608X08N]  (hidden comment: 100nF 50V X7R 0603)
C61  value 100nF  Voltage: 50V  Dielectric: X7R  [CAPC1608X08N]  (hidden comment: 100nF 50V X7R 0603)
C62  value 2u2  Voltage: 50V  Dielectric: X5R  [CAPC2012X14N]  (hidden comment: 2.2uF 50V 0805)
C63  value 22u  Voltage: 35V  Dielectric: X5R  [CAPC3225X18N]  (hidden comment: 22uF 35V 1210 X5R)
C64  value 22u  Voltage: 35V  Dielectric: X5R  [CAPC3225X18N]  (hidden comment: 22uF 35V 1210 X5R)
C65  value 22u  Voltage: 35V  Dielectric: X5R  [CAPC3225X18N]  (hidden comment: 22uF 35V 1210 X5R)
C66  value 22u  Voltage: 35V  Dielectric: X5R  [CAPC3225X18N]  (hidden comment: 22uF 35V 1210 X5R)
C67  value 22u  Voltage: 35V  Dielectric: X5R  [CAPC3225X18N]  (hidden comment: 22uF 35V 1210 X5R)
C68  value 22u  Voltage: 35V  Dielectric: X5R  [CAPC3225X18N]  (hidden comment: 22uF 35V 1210 X5R)
C69  value 4u7  Voltage: 50V  Dielectric: X5R  [CAPC2012X14N]  (hidden comment: 4.7uF 50V 0805)
C70  value 68p  Voltage: 50V  Dielectric: NP0  [CAPC1005X06N]  (hidden comment: 68pF 50V 0402)
C71  value 18n  Voltage: 50V  Dielectric: X7R  [CAPC1005X06N]  (hidden comment: 18nF 50V 0402)
C72  value 4n7  Voltage: 50V  Dielectric: X7R  [CAPC1005X06N]  (hidden comment: 4.7nF 50V X7R 0402)
L1  value 4u7  Saturation Current: 24A  [INDP134126X58N]  (hidden comment: 4.7uH 24A 20%)
NT1  8mil Net Tie  [Net Tie SMD-Footprint-1]  (value not drawn)  (net tie, no BOM)
NT2  8mil Net Tie  [Net Tie SMD-Footprint-1]  (value not drawn)  (net tie, no BOM)
Q1  CSD17579Q3A  [FP-DNH0008A-MFG]
Q2  CSD17579Q3A  [FP-DNH0008A-MFG]
R56  value 715k  Tolerance: 1%  [RESC1005X04M]  (hidden comment: 715k 1% 0402)
R57  value 0  Tolerance: 5%  [RESC1005X04M]  (hidden comment: 0 Ohm 1% 0402)
R58  value 0  Tolerance: 5%  [RESC1005X04M]  (hidden comment: 0 Ohm 1% 0402)
R59  value 100k  Tolerance: 1%  [RESC1005X04M]  (hidden comment: 100k 1% 0402)
R60  value 10m  Tolerance: 1%  [R1206]  (hidden comment: 10m 1W 1% 1206)
R61  value 100k  Tolerance: 1%  [RESC1005X04M]  (hidden comment: 100k 1% 0402)
R62  value 29k4  Tolerance: 1%  [RESC1005X04M]  (hidden comment: 29k4 1% 0402)
R63  value 20k  Tolerance: 1%  [RESC1005X04M]  (hidden comment: 20k 0402 1%)
R64  value 39k  Tolerance: 1%  [RESC1005X04M]  (hidden comment: 39k 1% 0402)
R65  value 59k  Tolerance: 1%  [RESC1005X04M]  (hidden comment: 59k 1% 0402)
R66  value 0  Tolerance: 5%  [RESC1005X04M]  (hidden comment: 0 Ohm 1% 0402)
U10  TPS55288RPMR  [FP-RPM0026A-MFG]

### Ports
PPHV (out, see DFP[2B], PD Controller[2B]), REG_I2C (harness I2C, see DFP[2B])

### Harnesses
I2C: SCL, SDA

### Nets
GND: C53.2 C54.2 C55.2 C56.2 C57.2 C58.2 C59.2 C62.2 C63.2 C64.2 C65.2 C66.2 C67.2 C68.2 C69.2 C70.2 C71.2 C72.2 Q2.1(S) Q2.2(S) Q2.3(S) R59.2 R62.2 R63.2 R64.2 R66.2 U10.9(PGND) U10.10(AGND) U10.15(MODE) U10.24(PGND)
VIN: C53.1 C54.1 C55.1 C56.1 C57.1 C58.1 C59.1 Q1.5-6-7-8(D) R56.1 U10.3(VIN)
BOOT1: C60.1 U10.22(BOOT1)
BOOT2: C61.1 U10.20(BOOT2)
CDC: R66.1 U10.16(CDC)
COMP: C70.1 R65.1 U10.18(COMP)
DITH: C71.1 U10.7(DITH/SYNC)
DR1H: R57.2 U10.2(DR1H)
DR1HG: Q1.4(G) R57.1
DR1L: R58.2 U10.1(DR1L)
DR1LG: Q2.4(G) R58.1
FB: R61.2 R62.1 U10.14(FB/~{INT})
FSW: R64.1 U10.8(FSW)
ILIM: R63.1 U10.17(ILIM)
IS_N: NT1.1 U10.13(ISN)
IS_P: NT2.1 U10.12(ISP)
PPHV: NT1.2 R60.2 R61.1 ; port PPHV
REG_VCC: C69.1 U10.19(VCC)
SW1: C60.2 L1.1 Q1.1(S) Q1.2(S) Q1.3(S) Q2.5-6-7-8(D) U10.23(SW1)
SW2: C61.2 L1.2 U10.21(SW2) U10.25(SW2)
UVLO: R56.2 R59.1 U10.4(EN/UVLO)
VOUT: C62.1 C63.1 C64.1 C65.1 C66.1 C67.1 C68.1 NT2.2 R60.1 U10.11(VOUT) U10.26(VOUT)
NetC72_1: C72.1 R65.2
NetU10_5: U10.5(SCL) ; port REG_I2C.SCL
NetU10_6: U10.6(SDA) ; port REG_I2C.SDA

### Channels
PORT1/PD Regulator: designators end in A; ports PPHV=PPHV
PORT2/PD Regulator: designators end in B; ports PPHV=PPHV
PORT3/PD Regulator: designators end in C; ports PPHV=PPHV
PORT4/PD Regulator: designators end in D; ports PPHV=PPHV

### Notes on the sheet
- (in symbol CMP-001-0002-2) NT

### Library data of the parts
C53 C62 = CMP-001-00094-1: 50V 2.2uF X5R ±10% 0805 Multilayer Ceramic Capacitors MLCC - SMD/SMT ROHS; LCSC Part #: C377773; Package: 0805
C54-C59 C63-C68 = CMP-001-00092-1: 35V 22uF X5R ±20% 1210 Multilayer Ceramic Capacitors MLCC - SMD/SMT ROHS; LCSC Part #: C778721; Package: 1210
C60 C61 = CMP-001-00093-1: 50V 100nF X7R ±10% 0603 Multilayer Ceramic Capacitors MLCC - SMD/SMT ROHS; LCSC Part #: C1591; Package: 0603
C69 = CMP-001-00089-1: 50V 4.7uF X5R ±10% 0805 Multilayer Ceramic Capacitors MLCC - SMD/SMT ROHS; LCSC Part #: C98192; Package: 0805
C70 = CMP-001-00113-1: 50V 68pF NP0 ±1% 0402 Multilayer Ceramic Capacitors MLCC - SMD/SMT ROHS; Package: 0402; LCSC Part #: C389103
C71 = CMP-001-00111-2: 50V 18nF X7R ±10% 0402 Multilayer Ceramic Capacitors MLCC - SMD/SMT ROHS; LCSC Part #: C576740; Package: 0402
C72 = CMP-001-00114-1: 50V 4.7nF X7R ±10% 0402 Multilayer Ceramic Capacitors MLCC - SMD/SMT ROHS; LCSC Part #: C1538; Package: 0402
L1 = CMP-006-00022-1: 20A 4.7uH Integrated molded inductor ±20% 24A SMD,12.6x13.5mm Power Inductors ROHS; Resistance: 9m; Rated Current: 20A; LCSC Part #: C526021
NT1 NT2 = CMP-001-0002-2: SMD Net Tie 8mil
Q1 Q2 = CMP-013-00041-1: MOSFET N-CH 30V 35A 8VSON; LCSC Part #: C97376
R56 = CMP-009-00228-2: 100mW Thick Film Resistors ±100ppm/℃ ±1% 715kΩ 0402 Chip Resistor - Surface Mount ROHS; LCSC Part #: C2480300; Package: 0402
R57 R58 R66 = CMP-009-00232-1: as R38 on sheet PD Controller; Package: 0402; LCSC Part #: C60485
R59 = CMP-009-00218-1: 62.5mW Thick Film Resistors 50V ±100ppm/℃ ±1% 100kΩ 0402 Chip Resistor - Surface Mount ROHS; LCSC Part #: C60491; Package: 0402
R60 = CMP-009-00229-1: 1W 10mΩ ±70ppm/℃ ±1% 1206 Current Sense Resistors / Shunt Resistors ROHS; LCSC Part #: C105362; Package: 1206
R61 = CMP-009-00218-2: as R35 on sheet DFP; Package: 0402; LCSC Part #: C60491
R62 = CMP-009-00230-2: 62.5mW Thick Film Resistors 50V ±100ppm/℃ ±1% 29.4kΩ 0402 Chip Resistor - Surface Mount ROHS; LCSC Part #: C26973; Package: 0402
R63 = CMP-009-00185-3: 62.5mW Thick Film Resistors 50V ±100ppm/℃ ±1% 20kΩ 0402 Chip Resistor - Surface Mount ROHS; LCSC Part #: C93942; Package: 0402
R64 = CMP-009-00231-1: 62.5mW Thick Film Resistors 50V ±100ppm/℃ ±1% 39kΩ 0402 Chip Resistor - Surface Mount ROHS; LCSC Part #: C137995; Package: 0402
R65 = CMP-009-00233-1: 62.5mW Thick Film Resistors 50V ±100ppm/℃ ±1% 59kΩ 0402 Chip Resistor - Surface Mount ROHS; LCSC Part #: C163459; Package: 0402
U10 = CMP-019-00063-2: 36V, 16A buck-boost converter with PPS control 26-VQFN-HR -40 to 150; LCSC Part #: C2864583

## Sheet UFP.SchDoc
size B; SheetNumber: 3; SheetTotal: 8
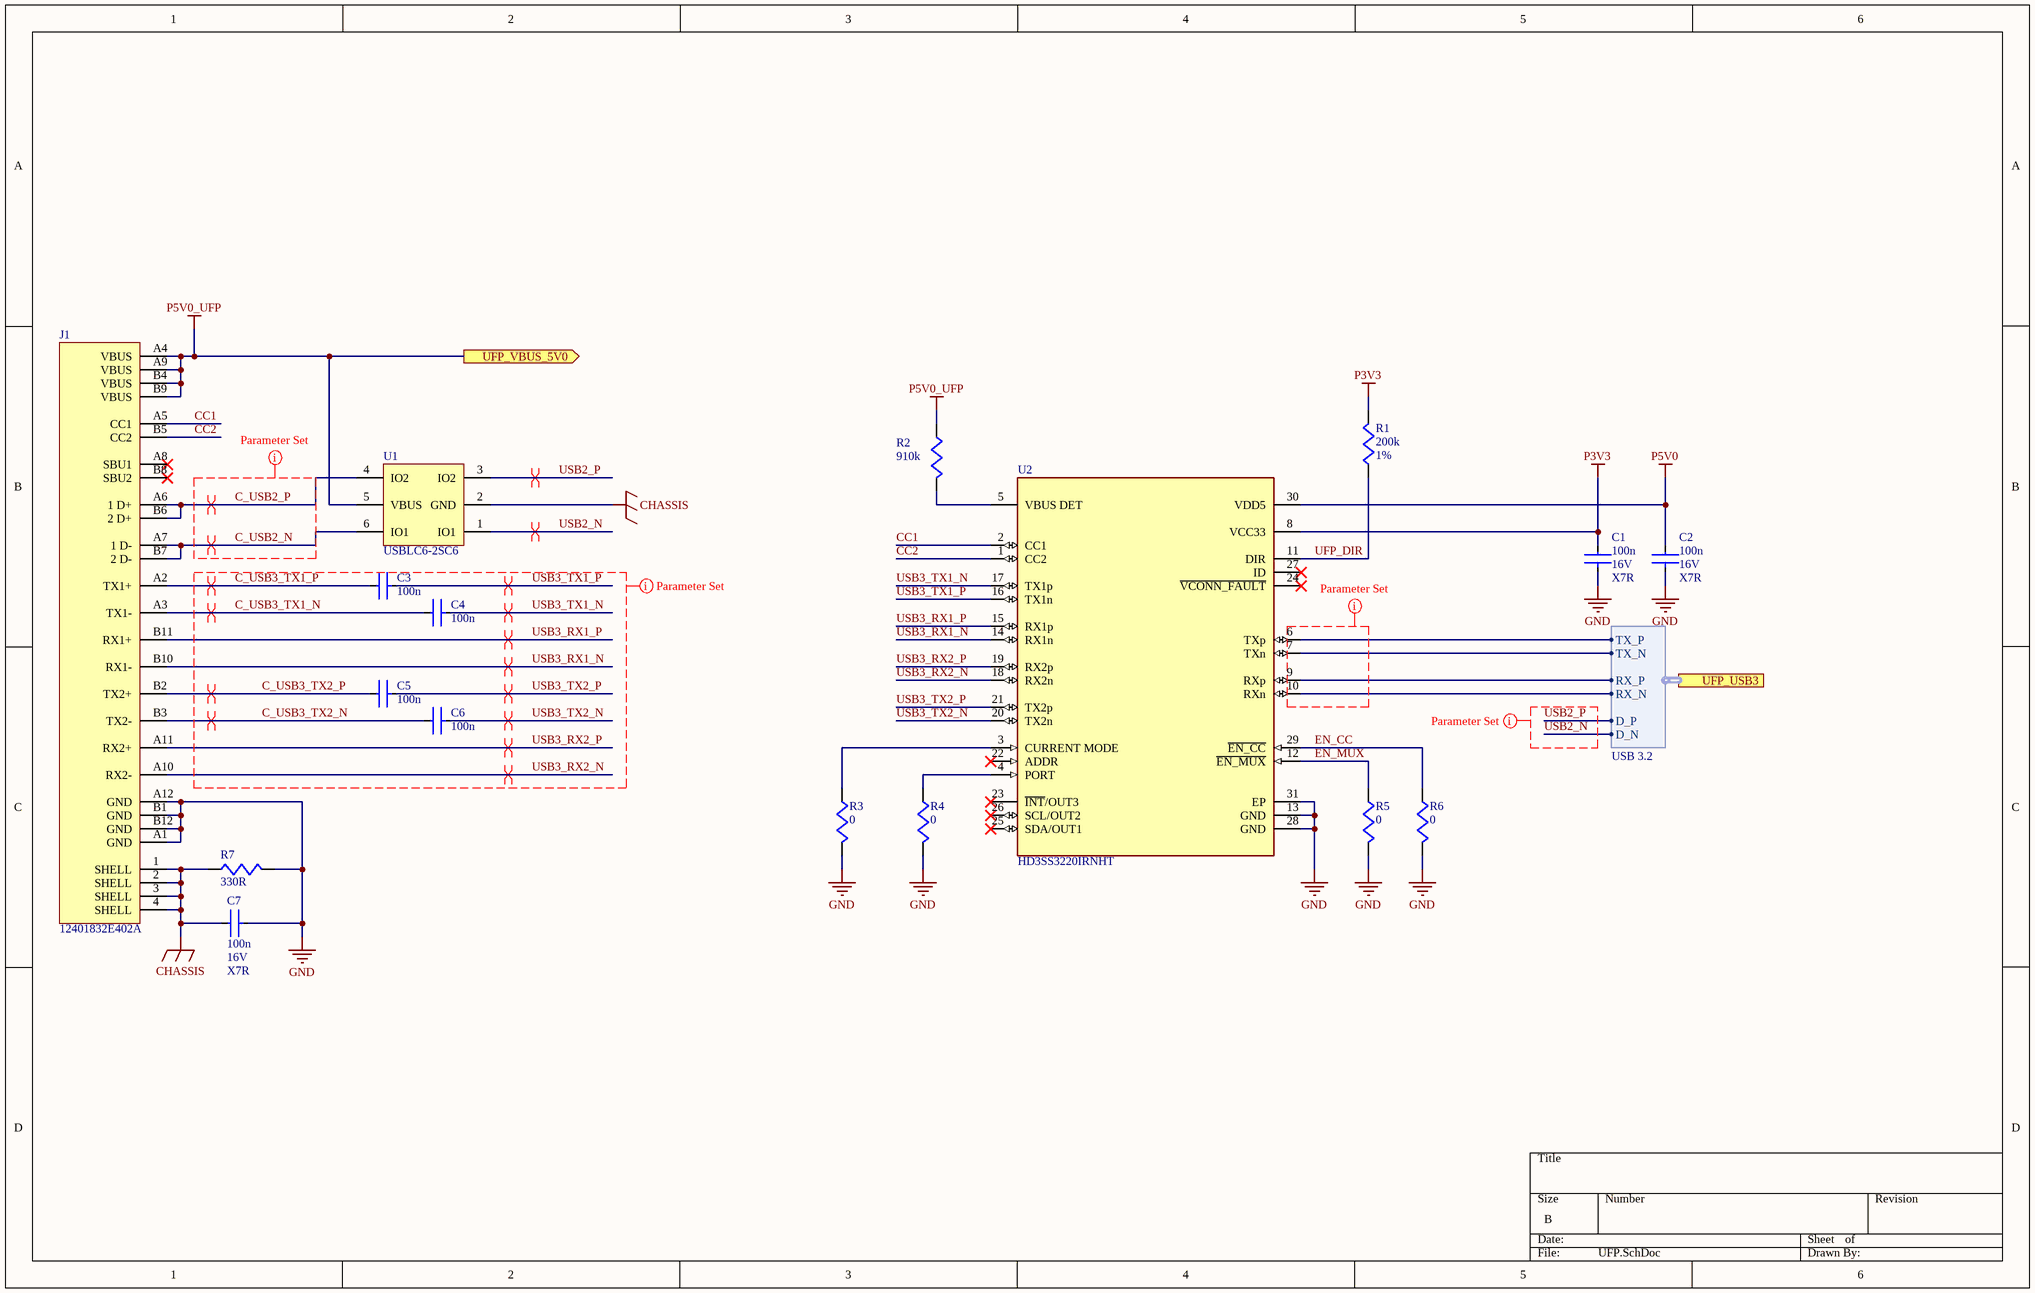
[diagram p4: UFP.SchDoc]

### Parts
C1  value 100n  Voltage: 16V  Dielectric: X7R  [CAPC1005X06N]  (hidden comment: 100nF 16V 0402)
C2  value 100n  Voltage: 16V  Dielectric: X7R  [CAPC1005X06N]  (hidden comment: 100nF 16V 0402)
C3  value 100n  [CAPC0603X03N]  (hidden comment: 100nF 10V 0201)
C4  value 100n  [CAPC0603X03N]  (hidden comment: 100nF 10V 0201)
C5  value 100n  [CAPC0603X03N]  (hidden comment: 100nF 10V 0201)
C6  value 100n  [CAPC0603X03N]  (hidden comment: 100nF 10V 0201)
C7  value 100n  Voltage: 16V  Dielectric: X7R  [CAPC1005X06N]  (hidden comment: 100nF 16V 0402)
J1  12401832E402A  [FP-12401832E402A-MFG]
R1  value 200k  Tolerance: 1%  [RESC1005X04M]  (hidden comment: 200k 1% 0402)
R2  value 910k  [RESC1005X04M]  (hidden comment: 910k 1% 0402)
R3  value 0  [RESC1508X05M]  (hidden comment: 0 Ohm 1% 0603)
R4  value 0  [RESC1508X05M]  (hidden comment: 0 Ohm 1% 0603)
R5  value 0  [RESC1508X05M]  (hidden comment: 0 Ohm 1% 0603)
R6  value 0  [RESC1508X05M]  (hidden comment: 0 Ohm 1% 0603)
R7  value 330R  [RESC1005X04M]  (hidden comment: 330R 1% 0402)
U1  USBLC6-2SC6  [SOT95P280X145-6N]
U2  HD3SS3220IRNHT  [FP-RNH0030A-MFG]

### Ports
UFP_USB3 (harness USB 3.2, see Main[1B], USB7206C[1D]), UFP_VBUS_5V0 (out, see Main[1B], USB7206C[1A])

### Harnesses
USB 3.2: D_N, D_P, TX_P, TX_N, RX_P, RX_N

### Nets
CHASSIS: C7.2 J1.1(SHELL) J1.2(SHELL) J1.3(SHELL) J1.4(SHELL) R7.1 U1.2(GND)
GND: C1.1 C2.1 C7.1 J1.A1(GND) J1.A12(GND) J1.B1(GND) J1.B12(GND) R3.2 R4.2 R5.2 R6.2 R7.2 U2.13(GND) U2.28(GND) U2.31(EP)
P3V3: C1.2 R1.2 U2.8(VCC33)
P5V0: C2.2 U2.30(VDD5)
P5V0_UFP: J1.A4(VBUS) J1.A9(VBUS) J1.B4(VBUS) J1.B9(VBUS) R2.1 U1.5(VBUS) ; port UFP_VBUS_5V0
C_USB2_N: J1.A7(1_D-) J1.B7(2_D-) U1.6(IO1)
C_USB2_P: J1.A6(1_D+) J1.B6(2_D+) U1.4(IO2)
C_USB3_TX1_N: C4.2 J1.A3(TX1-)
C_USB3_TX1_P: C3.2 J1.A2(TX1+)
C_USB3_TX2_N: C6.2 J1.B3(TX2-)
C_USB3_TX2_P: C5.2 J1.B2(TX2+)
CC1: J1.A5(CC1) U2.2(CC1)
CC2: J1.B5(CC2) U2.1(CC2)
EN_CC: R6.1 U2.29(~{EN_CC})
EN_MUX: R5.1 U2.12(~{EN_MUX})
UFP_DIR: R1.1 U2.11(DIR)
UP_USB3_RX_N: U2.10(RXn) ; port UFP_USB3.RX_N
UP_USB3_RX_P: U2.9(RXp) ; port UFP_USB3.RX_P
UP_USB3_TX_N: U2.7(TXn) ; port UFP_USB3.TX_N
UP_USB3_TX_P: U2.6(TXp) ; port UFP_USB3.TX_P
USB2_N: U1.1(IO1) ; port UFP_USB3.D_N  [project net UP_USB2_N]
USB2_P: U1.3(IO2) ; port UFP_USB3.D_P  [project net UP_USB2_P]
USB3_RX1_N: J1.B10(RX1-) U2.14(RX1n)
USB3_RX1_P: J1.B11(RX1+) U2.15(RX1p)
USB3_RX2_N: J1.A10(RX2-) U2.18(RX2n)
USB3_RX2_P: J1.A11(RX2+) U2.19(RX2p)
USB3_TX1_N: C4.1 U2.17(TX1p)
USB3_TX1_P: C3.1 U2.16(TX1n)
USB3_TX2_N: C6.1 U2.20(TX2n)
USB3_TX2_P: C5.1 U2.21(TX2p)
NetR2_2: R2.2 U2.5(VBUS_DET)
NetR3_1: R3.1 U2.3(CURRENT_MODE)
NetR4_1: R4.1 U2.4(PORT)

Not connected (* = marked no-connect by the designer): J1 A8(SBU1)* B8(SBU2)*; U2 22(ADDR)* 23(~{INT}/OUT3)* 24(~{VCONN_FAULT})* 25(SDA/OUT1)* 26(SCL/OUT2)* 27(ID)*

### Layout directives
differential pair; differential pair class DIFF90: C_USB2_N, C_USB2_P, C_USB3_TX1_N, C_USB3_TX1_P, C_USB3_TX2_N, C_USB3_TX2_P, UP_USB2_N, UP_USB2_P, USB3_RX1_N, USB3_RX1_P, USB3_RX2_N, USB3_RX2_P, USB3_TX1_N, USB3_TX1_P, USB3_TX2_N, USB3_TX2_P
net class USB2: C_USB2_N, C_USB2_P, USB2_N, USB2_P
net class USB3: (no net found under the mark), C_USB3_TX1_N, C_USB3_TX1_P, C_USB3_TX2_N, C_USB3_TX2_P, USB3_RX1_N, USB3_RX1_P, USB3_RX2_N, USB3_RX2_P, USB3_TX1_N, USB3_TX1_P, USB3_TX2_N, USB3_TX2_P

### Library data of the parts
C1 C2 = CMP-001-00088-1: as C40 on sheet DFP; LCSC Part #: C1525; Package: 0402
C3-C6 = CMP-001-00107-1: 10V 100nF X5R ±10% 0201 Multilayer Ceramic Capacitors MLCC - SMD/SMT ROHS; Voltage: 10V; Dielectric: X5R; Package: 0402; LCSC Part #: C76934
C7 = CMP-001-00088-2: as C8 on sheet Main; LCSC Part #: C1525; Package: 0402
J1 = CMP-002-00130-1: as J3 on sheet DFP; LCSC Part #: C464604
R1 = CMP-009-00220-2: 62.5mW Thick Film Resistors 50V ±100ppm/℃ ±1% 200kΩ 0402 Chip Resistor - Surface Mount ROHS; Package: 0402; LCSC Part #: C114763
R2 = CMP-009-00225-1: 62.5mW Thick Film Resistors 50V ±100ppm/℃ ±1% 910kΩ 0402 Chip Resistor - Surface Mount ROHS; Tolerance: 1%; LCSC Part #: C137927; Package: 0402
R3-R6 = CMP-009-00190-2: 62.5mW Thick Film Resistors 50V 0Ω 0402 Chip Resistor - Surface Mount ROHS; Tolerance: 1%; Package: 0603; LCSC Part #: C60485
R7 = CMP-009-00201-3: as R14 on sheet Main; Tolerance: 1%; LCSC Part #: C105875; Package: 0402
U1 = CMP-015-00019-2: Trans Voltage Suppressor Diode, 5V V(RWM), Unidirectional, 1 Element, Silicon; LCSC Part #: C7519
U2 = CMP-001-0008-5: 10-Gbps USB 3.1 Type-C 2: 1 mux with DRP Controller 30-WQFN -40 to 85; LCSC Part #: C165155

## Sheet STM32F070CBT6.SchDoc
size A; SheetNumber: 8; SheetTotal: 8
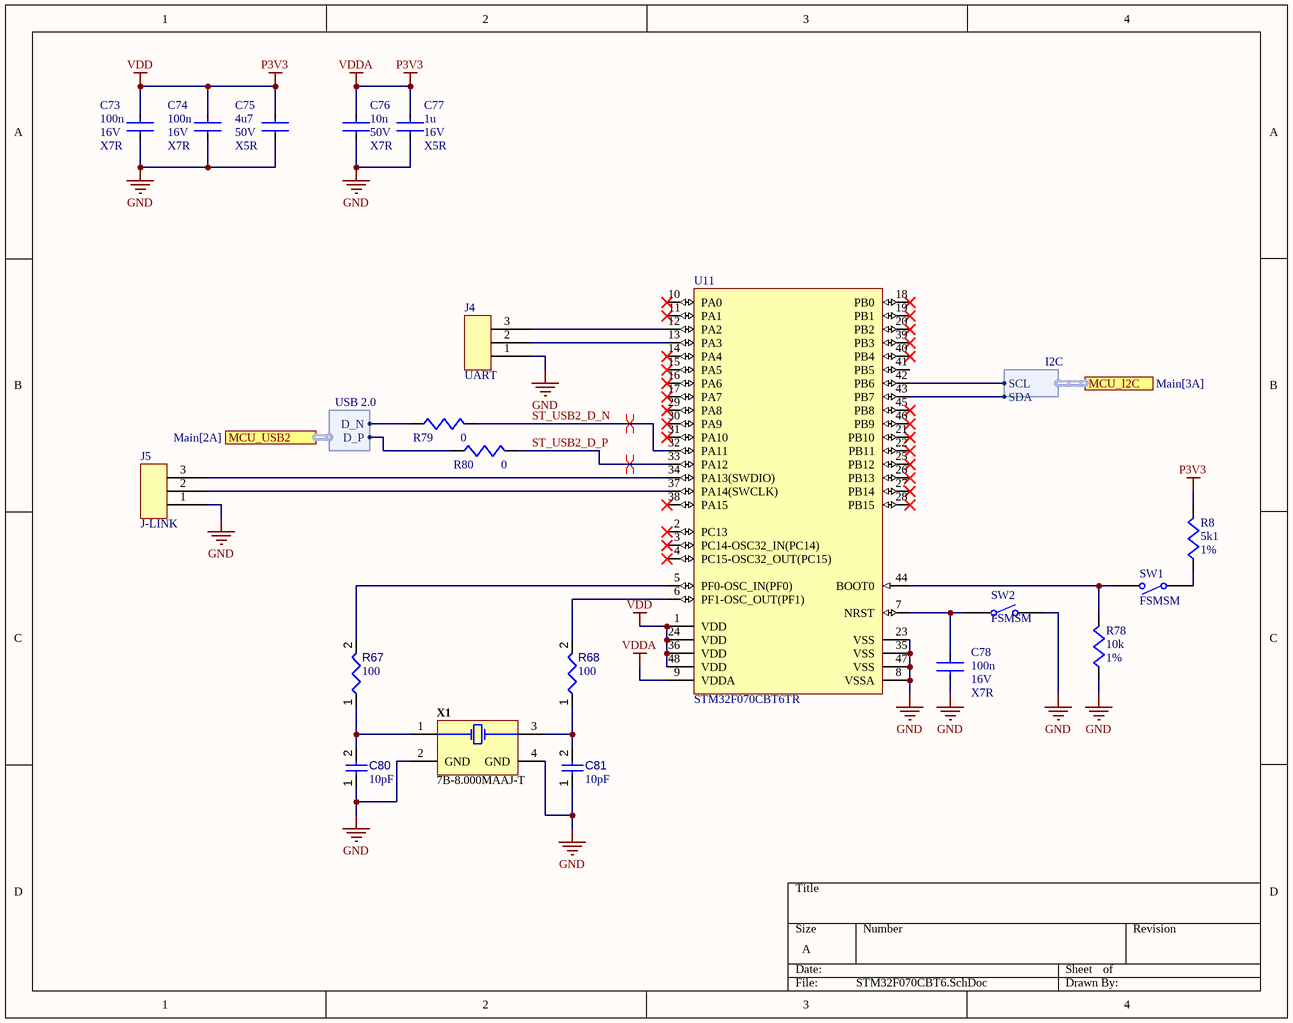
[diagram p5: STM32F070CBT6.SchDoc]

### Parts
C73  value 100n  Voltage: 16V  Dielectric: X7R  [CAPC1005X06N]  (hidden comment: 100nF 16V 0402)
C74  value 100n  Voltage: 16V  Dielectric: X7R  [CAPC1005X06N]  (hidden comment: 100nF 16V 0402)
C75  value 4u7  Voltage: 50V  Dielectric: X5R  [CAPC2012X14N]  (hidden comment: 4.7uF 50V 0805)
C76  value 10n  Voltage: 50V  Dielectric: X7R  [CAPC1608X08N]  (hidden comment: 10n 50V X7R 0603)
C77  value 1u  Voltage: 16V  Dielectric: X5R  [CAPC1005X06N]  (hidden comment: 1uF 16V X5R 0402)
C78  value 100n  Voltage: 16V  Dielectric: X7R  [CAPC1005X06N]  (hidden comment: 100nF 16V 0402)
C80  value 10pF  [CAPC1005X55X25ML05T05]  (hidden comment: Capacitor 10 pF +/- 5% 50 V 0402)
C81  value 10pF  [CAPC1005X55X25ML05T05]  (hidden comment: Capacitor 10 pF +/- 5% 50 V 0402)
J4  UART  [3x0.1" Header-Footprint-1]
J5  J-LINK  [3x0.1" Header-Footprint-1]
R8  value 5k1  Tolerance: 1%  [RESC1508X05M]  (hidden comment: 5k1 1% 0603)
R67  value 100  [RESC0402(1005)_L]  (hidden comment: 100R2F)
R68  value 100  [RESC0402(1005)_L]  (hidden comment: 100R2F)
R78  value 10k  Tolerance: 1%  [RESC1005X04M]  (hidden comment: 10k 1% 0402)
R79  value 0  [RESC1508X05M]  (hidden comment: 0 Ohm 1% 0603)
R80  value 0  [RESC1508X05M]  (hidden comment: 0 Ohm 1% 0603)
SW1  FSMSM  [TECO-FSMSM-2_V]
SW2  FSMSM  [TECO-FSMSM-2_V]
U11  STM32F070CBT6TR  [STM-LQFP48_N]
X1  7B-8.000MAAJ-T  [TXC-7B-4_V]

### Ports
MCU_I2C (harness I2C, see Main[3A]), MCU_USB2 (harness USB 2.0, see Main[2A])

### Harnesses
USB 2.0: D_P, D_N
I2C: SCL, SDA

### Nets
GND: C73.2 C74.2 C75.2 C76.2 C77.2 C78.1 C80.1 C81.1 J4.1 J5.1 R78.1 SW2.2 U11.8(VSSA) U11.23(VSS) U11.35(VSS) U11.47(VSS) X1.2(GND) X1.4(GND)
P3V3: C73.1 C74.1 C75.1 C76.1 C77.1 R8.2 U11.1(VDD) U11.9(VDDA) U11.24(VDD) U11.36(VDD) U11.48(VDD)  [also labelled VDD, VDDA]
DP6_USB2_N: R79.1 ; port MCU_USB2.D_N
DP6_USB2_P: R80.1 ; port MCU_USB2.D_P
I2C1_SCL: U11.42(PB6) ; port MCU_I2C.SCL
I2C1_SDA: U11.43(PB7) ; port MCU_I2C.SDA
ST_USB2_D_N: R79.2 U11.32(PA11)
ST_USB2_D_P: R80.2 U11.33(PA12)
NetC78_2: C78.2 SW2.1 U11.7(NRST)
NetC80_2: C80.2 R67.1 X1.1(X1)
NetC81_2: C81.2 R68.1 X1.3(X2)
NetJ4_2: J4.2 U11.13(PA3)
NetJ4_3: J4.3 U11.12(PA2)
NetJ5_2: J5.2 U11.37(PA14(SWCLK))
NetJ5_3: J5.3 U11.34(PA13(SWDIO))
NetR8_1: R8.1 SW1.1
NetR67_2: R67.2 U11.5(PF0-OSC_IN(PF0))
NetR68_2: R68.2 U11.6(PF1-OSC_OUT(PF1))
NetR78_2: R78.2 SW1.2 U11.44(BOOT0)

Not connected (* = marked no-connect by the designer): U11 2(PC13)* 3(PC14-OSC32_IN(PC14))* 4(PC15-OSC32_OUT(PC15))* 10(PA0)* 11(PA1)* 14(PA4)* 15(PA5)* 16(PA6)* 17(PA7)* 18(PB0)* 19(PB1)* 20(PB2)* 21(PB10)* 22(PB11)* 25(PB12)* 26(PB13)* 27(PB14)* 28(PB15)* 29(PA8)* 30(PA9)* 31(PA10)* 38(PA15)* 39(PB3)* 40(PB4)* 41(PB5) 45(PB8)* 46(PB9)*

### Layout directives
differential pair: ST_USB2_D_N, ST_USB2_D_P

### Library data of the parts
C73 C74 C78 = CMP-001-00088-1: as C40 on sheet DFP; LCSC Part #: C1525; Package: 0402
C75 = CMP-001-00089-1: as C69 on sheet PD Regulator; LCSC Part #: C98192; Package: 0805
C76 = CMP-001-00106-1: 50V 10nF X7R ±10% 0603 Multilayer Ceramic Capacitors MLCC - SMD/SMT ROHS; LCSC Part #: C100042; Package: 0603
C77 = CMP-001-00098-1: 16V 1uF X5R ±10% 0402 Multilayer Ceramic Capacitors MLCC - SMD/SMT ROHS; LCSC Part #: C29266; Package: 0402
C80 C81 = CMP-001-00013-6: Chip Capacitor, 10 pF, +/- 5%, 50 V, 0402 (1005 Metric); Capacitor Type: Ceramic; Voltage Rating: 50V; Max Operating Temperature: 125°C; Pins: 2; Mounting Technology: SM; Tolerance: 5%; RoHS Compliant: True; Case/Package: 0402; Min Operating Temperature: -55°C
J4 J5 = CMP-002-00078-3: 3x0.1" pitch header
R8 = CMP-009-00204-2: 100mW Thick Film Resistors 75V ±100ppm/℃ ±1% 5.1kΩ 0603 Chip Resistor - Surface Mount ROHS; LCSC Part #: C105580; Package: 0603
R67 R68 = CMP-009-00065-2: 100R 0.063W 1% 0402 (1005 Metric)  SMD; Power: 63mW; Tolerance: 1%; Case/Package: 0402; Pins: 2; Mounting Technology: SMT
R78 = CMP-009-00187-2: as R39 on sheet PD Controller; Package: 0402; LCSC Part #: C60490
R79 R80 = CMP-009-00190-2: as R3 on sheet UFP; Tolerance: 1%; Package: 0603; LCSC Part #: C60485
SW1 SW2 = CMP-011-00013-1: Switch Tactile OFF (ON) SPST Rectangular Button Gull Wing 0.05A 12VDC SMD Loose Piece
U11 = CMP-020-00035-1: Mainstream ARM Cortex-M0 Value line MCU with 128 Kbytes Flash, 48 MHz CPU, USB
X1 = CMP-003-00013-2: SMD Seam Sealing Crystal, 8 MHz, +/- 30 ppm, 18 pF, -10 to 70 degC, 4-Pin SMD, RoHS, Tape and Reel; Manufacturer: TXC; Frequency: 8MHz; Resistance: 100Ohm; Tolerance: 30ppm; Load Capacitance: 18pF; ESR: 100; Package Quantity: 1000; Datasheet URL: http://www.txccorp.com/download/products/quartz_crystals/2015TXC_7B_19.pdf; Case/Package: 7B-4; Packaging: TapeandReel; Frequency Tolerance: 30ppm; Min Operating Temperature: -20°C; RoHS Compliant: True; Package Reference: 7B-4; Mounting Technology: SM; Datasheet Version: Jul-15; Max Operating Temperature: 70°C; Package Description: 4-Pin Surface Mount Device, Body 5 x 3.2 mm, Pitch 3.7 mm; Pins: 4